# EasyEDA Pro project ProPrj_obstacleavoidanceunit_2025-12-17.epro

# Schematic Schematic1

## Sheets
1 Mux: Board Name: Board1; Create Date: 2025-10-27; Page Name: Mux; Project Name: obstacleavoidanceunit; Schematic Name: Schematic1; Update Date: 2025-11-10; Company: EasyEDA.com; Page Size: A4; Version: V1.0
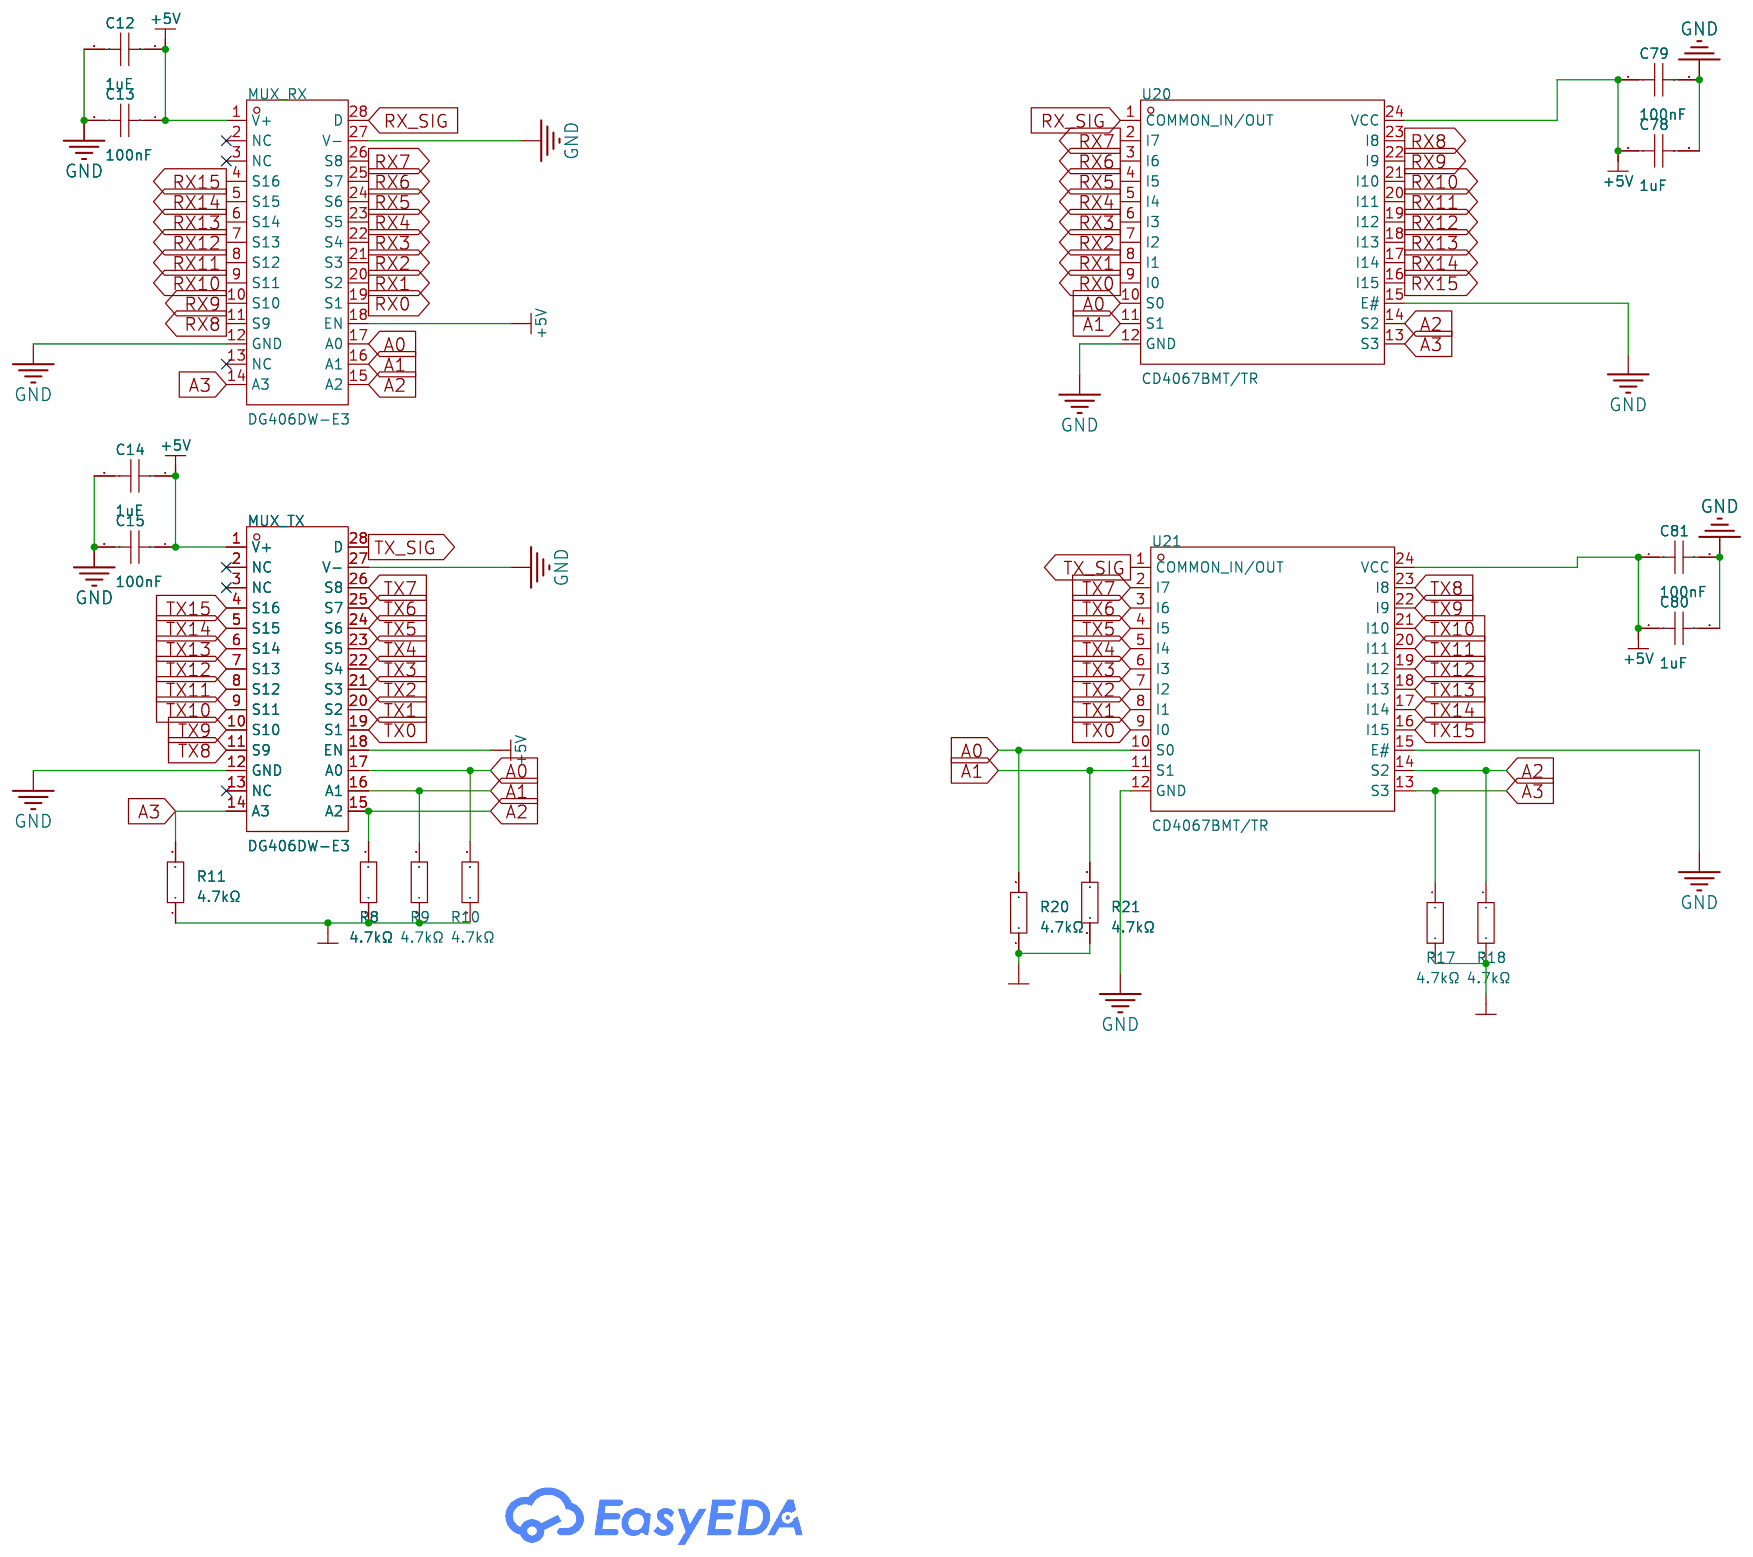
[diagram p0: Mux]
2 Power: Create Date: 2025-10-30; Page Name: Power
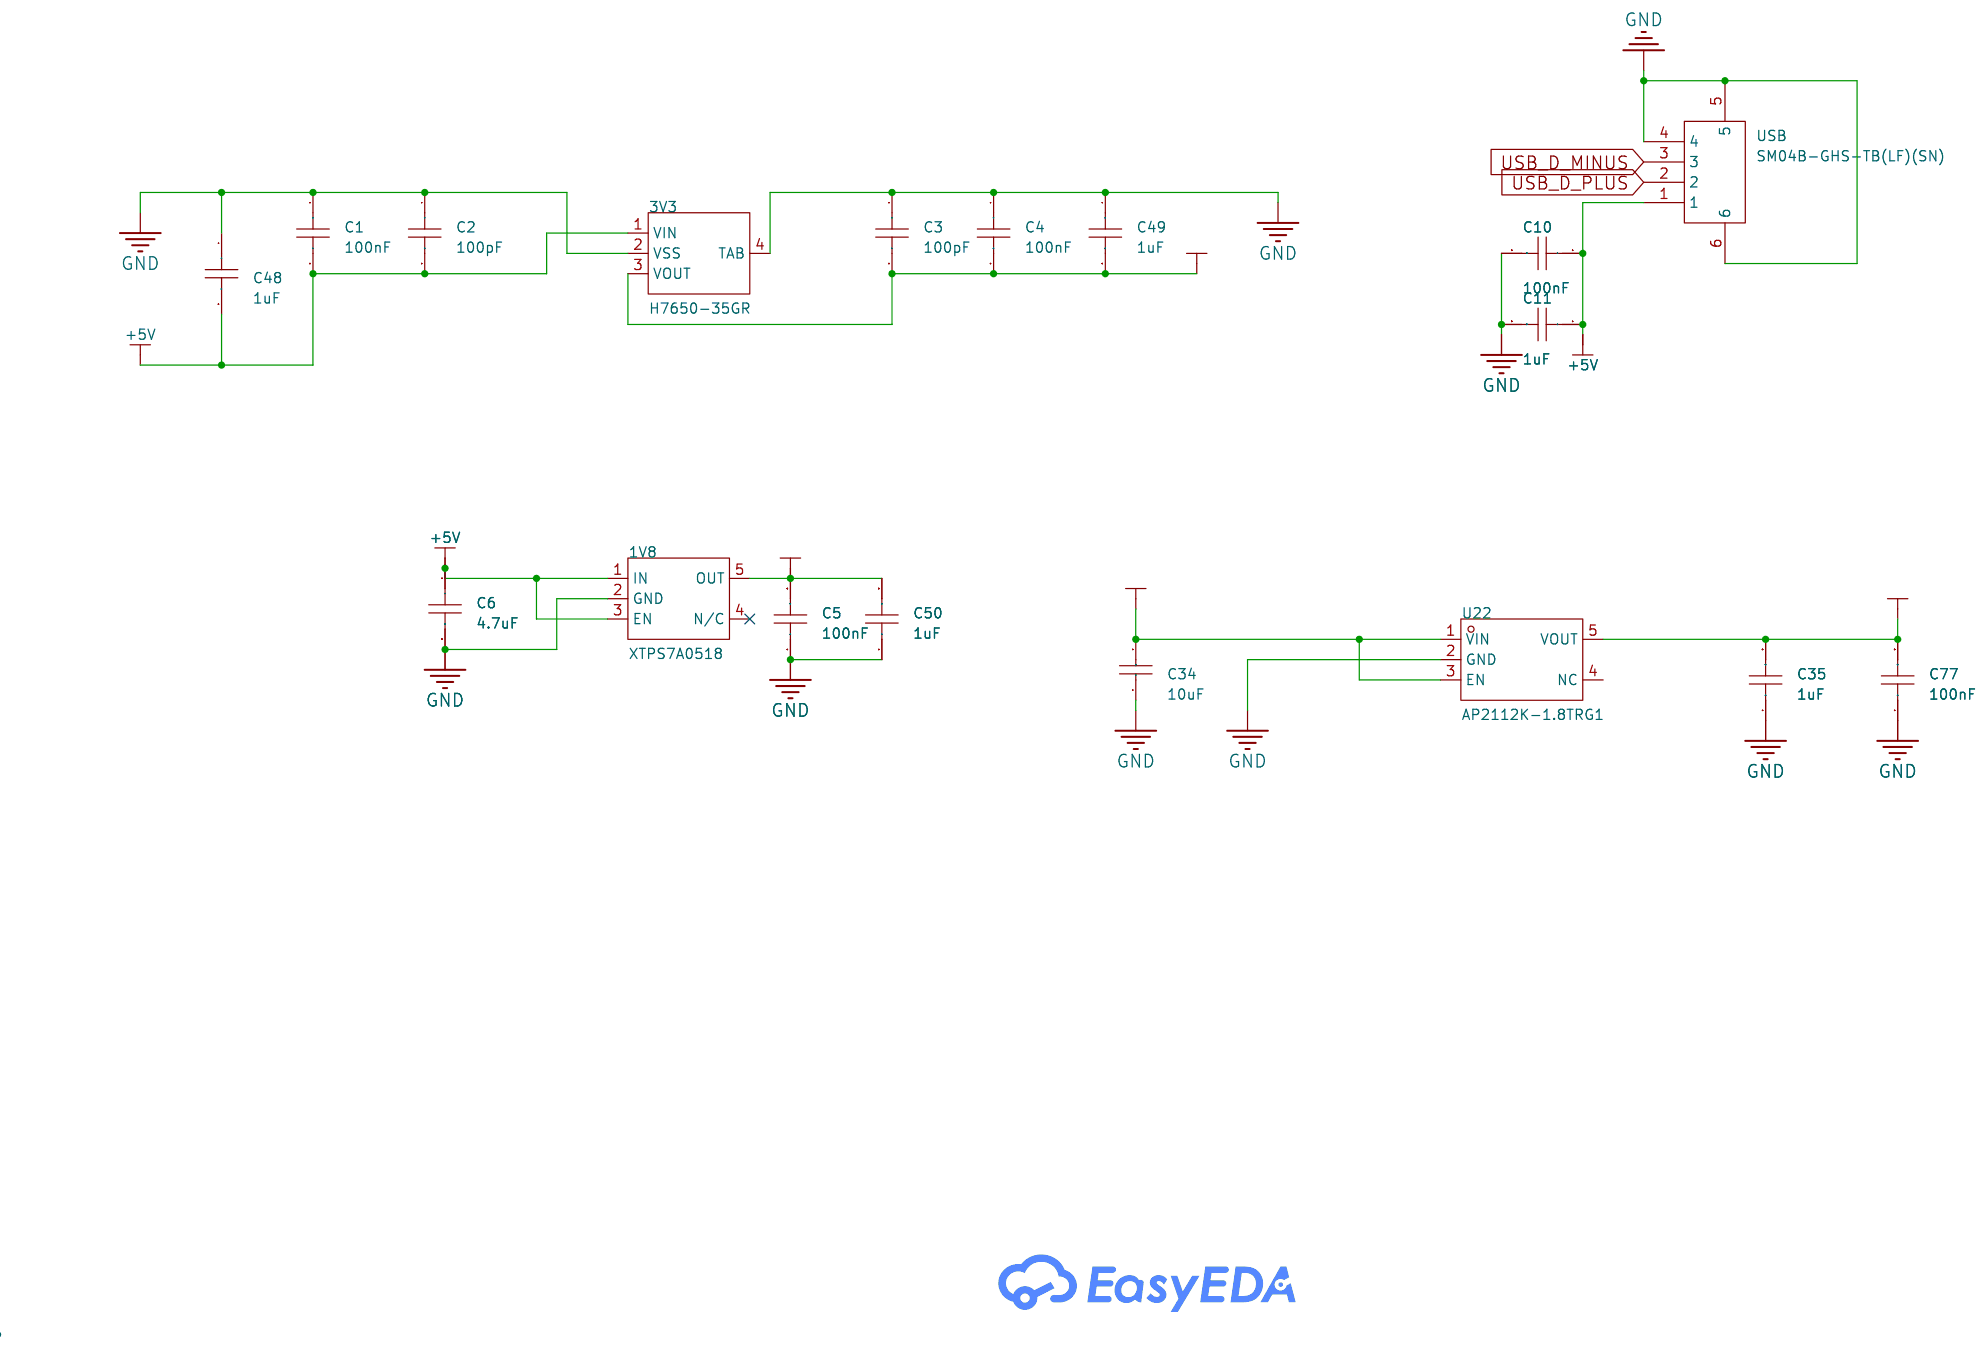
[diagram p1: Power]
3 ESP: Create Date: 2025-11-09; Page Name: ESP
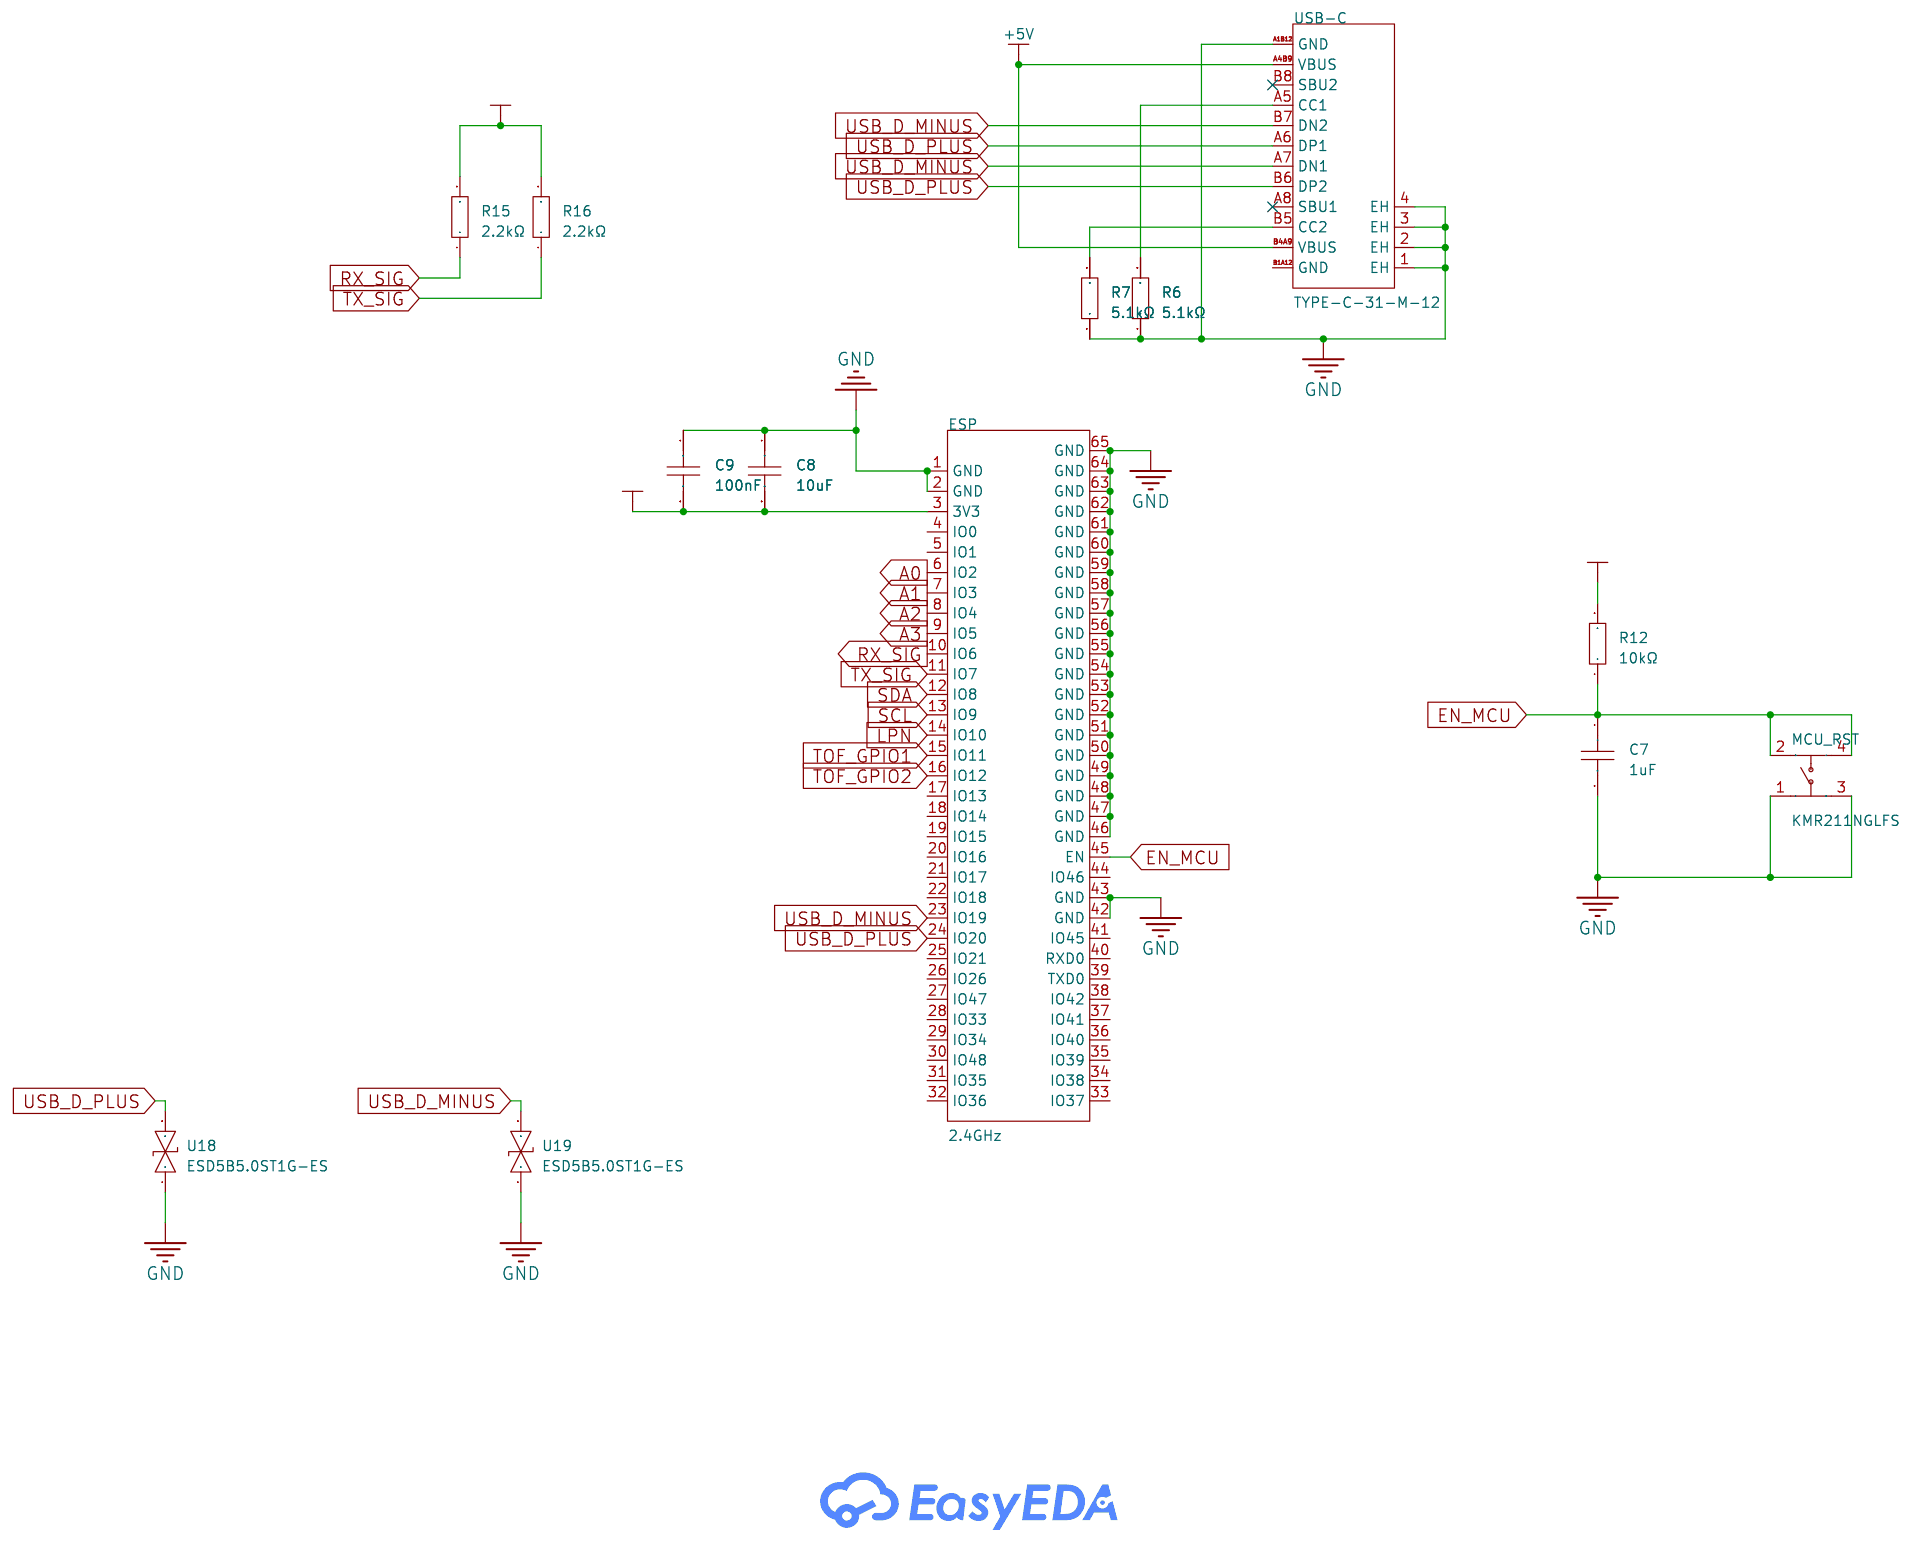
[diagram p2: ESP]
4 connectors: Create Date: 2025-11-10; Page Name: connectors
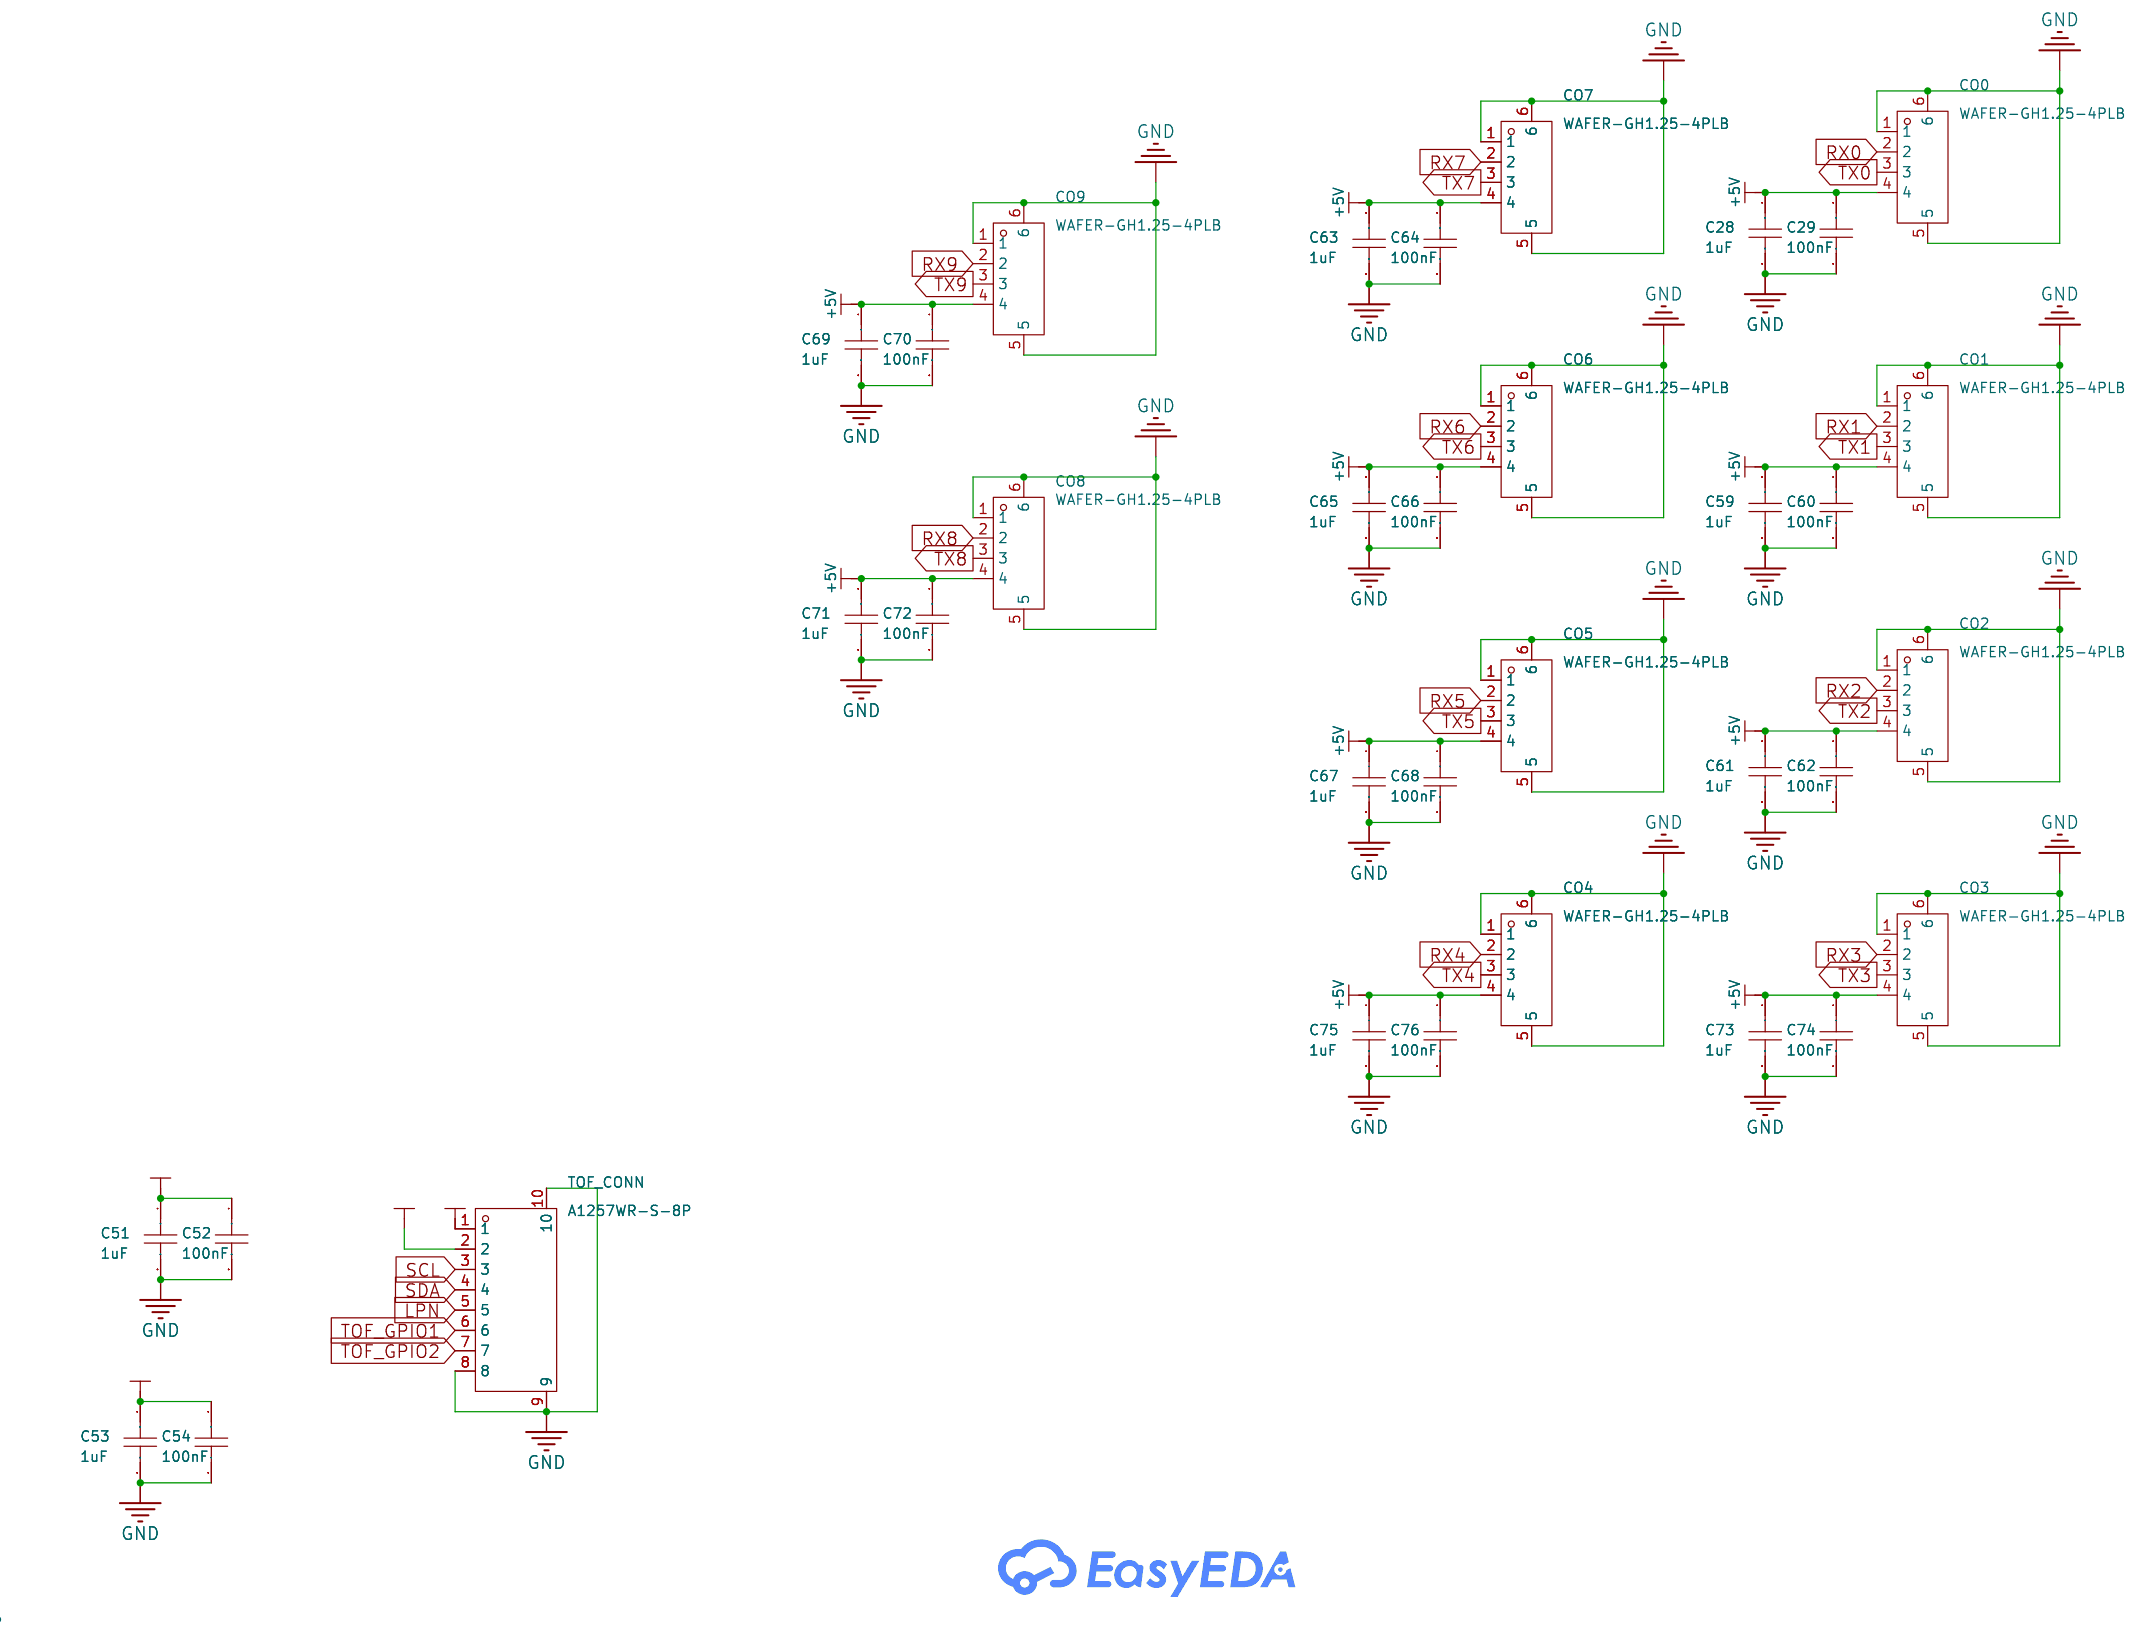
[diagram p3: connectors]
5 TOF: Create Date: 2025-11-10; Page Name: TOF; Drawn: EasyEDA; Part Number: JLCPCB-002; Reviewed: EasyEDA; Version: V0.1
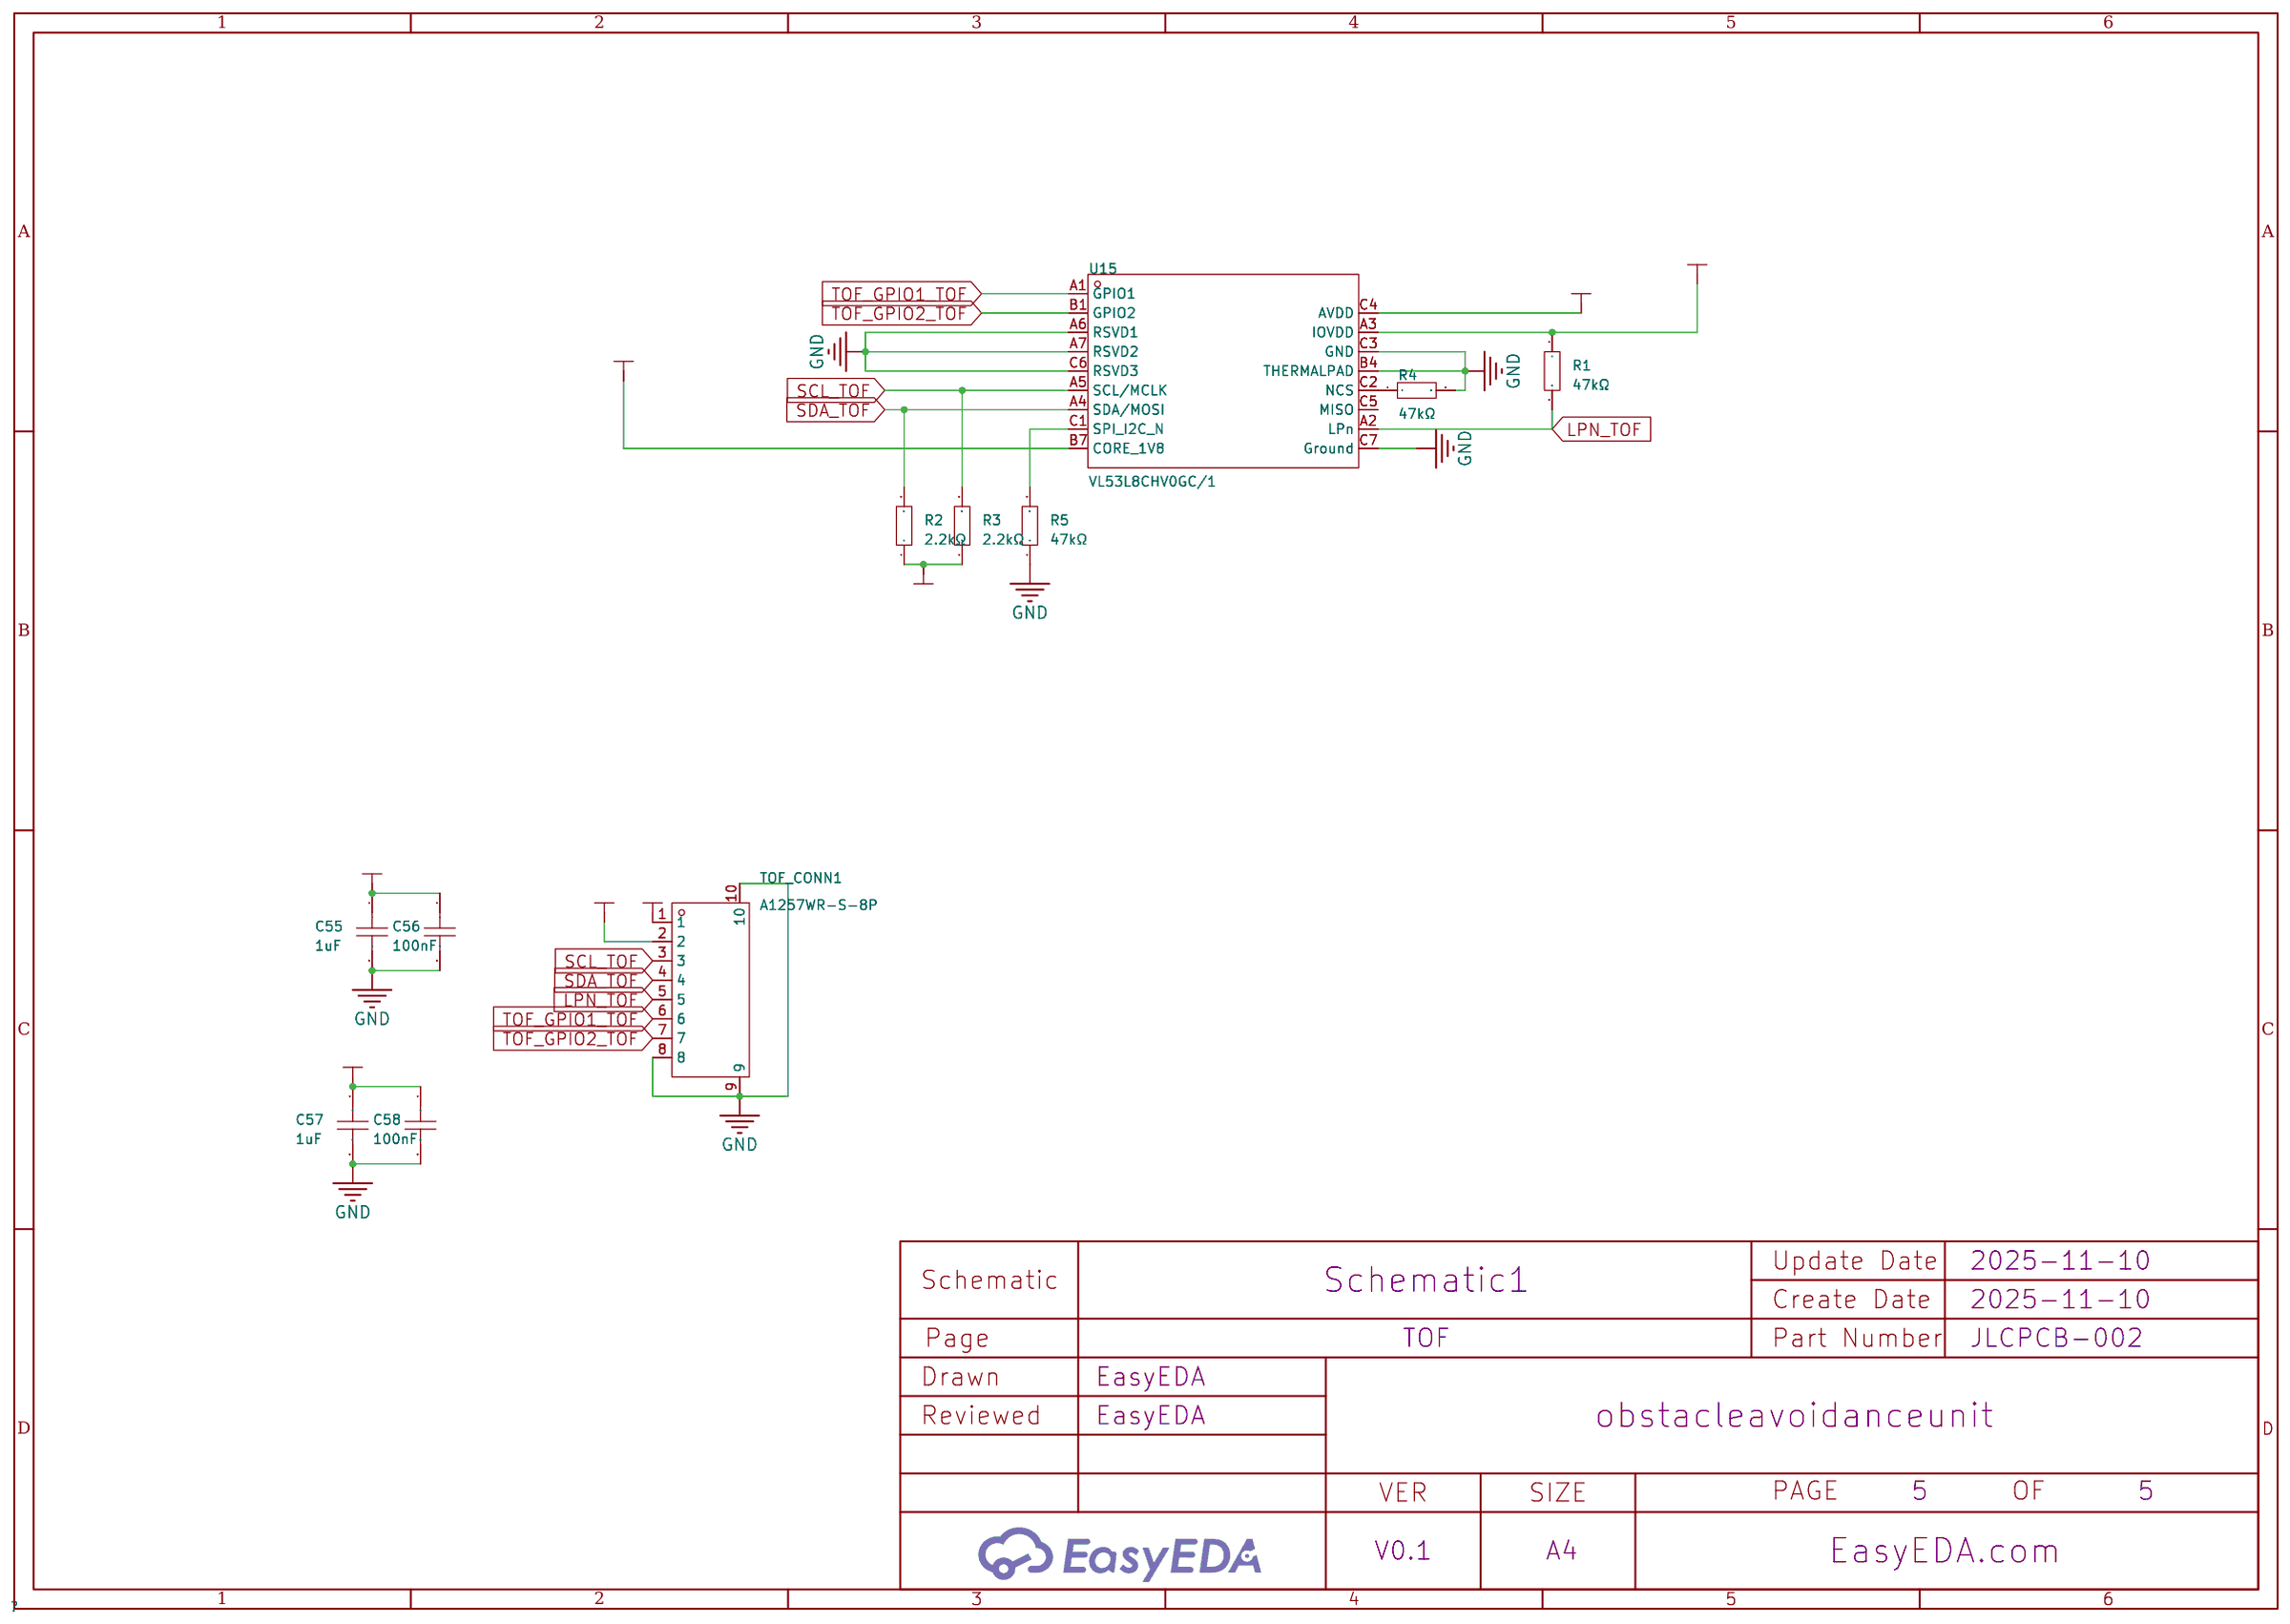
[diagram p4: TOF]

## Parts
sheet connectors
C28  1uF  [C0603]
C29  100nF  [C0603]
C51  1uF  [C0603]
C52  100nF  [C0603]
C53  1uF  [C0603]
C54  100nF  [C0603]
C59  1uF  [C0603]
C60  100nF  [C0603]
C61  1uF  [C0603]
C62  100nF  [C0603]
C63  1uF  [C0603]
C64  100nF  [C0603]
C65  1uF  [C0603]
C66  100nF  [C0603]
C67  1uF  [C0603]
C68  100nF  [C0603]
C69  1uF  [C0603]
C70  100nF  [C0603]
C71  1uF  [C0603]
C72  100nF  [C0603]
C73  1uF  [C0603]
C74  100nF  [C0603]
C75  1uF  [C0603]
C76  100nF  [C0603]
CO0  WAFER-GH1.25-4PLB  [CONN-SMD_4P-P1.25_XUNPU_WAFER-GH1.25-4PLB]
CO1  WAFER-GH1.25-4PLB  [CONN-SMD_4P-P1.25_XUNPU_WAFER-GH1.25-4PLB]
CO2  WAFER-GH1.25-4PLB  [CONN-SMD_4P-P1.25_XUNPU_WAFER-GH1.25-4PLB]
CO3  WAFER-GH1.25-4PLB  [CONN-SMD_4P-P1.25_XUNPU_WAFER-GH1.25-4PLB]
CO4  WAFER-GH1.25-4PLB  [CONN-SMD_4P-P1.25_XUNPU_WAFER-GH1.25-4PLB]
CO5  WAFER-GH1.25-4PLB  [CONN-SMD_4P-P1.25_XUNPU_WAFER-GH1.25-4PLB]
CO6  WAFER-GH1.25-4PLB  [CONN-SMD_4P-P1.25_XUNPU_WAFER-GH1.25-4PLB]
CO7  WAFER-GH1.25-4PLB  [CONN-SMD_4P-P1.25_XUNPU_WAFER-GH1.25-4PLB]
CO8  WAFER-GH1.25-4PLB  [CONN-SMD_4P-P1.25_XUNPU_WAFER-GH1.25-4PLB]
CO9  WAFER-GH1.25-4PLB  [CONN-SMD_4P-P1.25_XUNPU_WAFER-GH1.25-4PLB]
TOF_CONN  A1257WR-S-8P  [CONN-SMD_A1257WR-S-8P]
sheet ESP
C7  1uF  [C0603]
C8  10uF  [C0603]
C9  100nF  [C0603]
ESP  2.4GHz  [BULETM-SMD_ESPRESSIF_ESP32-S3-MINI-1U-N8]
MCU_RST  KMR211NGLFS  [SW-SMD_4P-L4.2-W2.8-P1.60-LS4.6-TR]
R6  5.1kΩ  [R0603]
R7  5.1kΩ  [R0603]
R12  10kΩ  [R0603]
R15  2.2kΩ  [R0603]
R16  2.2kΩ  [R0603]
U18  ESD5B5.0ST1G-ES  [SOD-523_L1.2-W0.8-LS1.6-BI]
U19  ESD5B5.0ST1G-ES  [SOD-523_L1.2-W0.8-LS1.6-BI]
USB-C  TYPE-C-31-M-12  [USB-C_SMD-TYPE-C-31-M-12_1]
sheet Mux
C12  1uF  [C0603]  (no BOM)
C13  100nF  [C0603]  (no BOM)
C14  1uF  [C0603]  (no BOM)
C15  100nF  [C0603]  (no BOM)
C78  1uF  [C0603]
C79  100nF  [C0603]
C80  1uF  [C0603]
C81  100nF  [C0603]
MUX_RX  DG406DW-E3  [SOIC-28_L17.9-W7.5-P1.27-LS10.3-BL]  (no BOM)
MUX_TX  DG406DW-E3  [SOIC-28_L17.9-W7.5-P1.27-LS10.3-BL]  (no BOM)
R8  4.7kΩ  [R0603]  (no BOM)
R9  4.7kΩ  [R0603]  (no BOM)
R10  4.7kΩ  [R0603]  (no BOM)
R11  4.7kΩ  [R0603]  (no BOM)
R17  4.7kΩ  [R0603]
R18  4.7kΩ  [R0603]
R20  4.7kΩ  [R0603]
R21  4.7kΩ  [R0603]
U20  CD4067BMT/TR  [TSSOP-24_L7.8-W4.4-P0.65-LS6.4-BL_1]
U21  CD4067BMT/TR  [TSSOP-24_L7.8-W4.4-P0.65-LS6.4-BL_1]
sheet Power
1V8  XTPS7A0518  [SOT-23-5_L2.9-W1.6-P0.95-LS2.8-BL]  (no BOM)
3V3  H7650-35GR  [SOT-223-3_L6.5-W3.4-P2.30-LS7.0-BR]
C1  100nF  [C0402]
C2  100pF  [C0402]
C3  100pF  [C0402]
C4  100nF  [C0402]
C5  100nF  [C0402]  (no BOM)
C6  4.7uF  [C0603]  (no BOM)
C10  100nF  [C0603]
C11  1uF  [C0603]
C34  10uF  [C0402]
C35  1uF  [C0603]
C48  1uF  [C0603]
C49  1uF  [C0603]
C50  1uF  [C0603]  (no BOM)
C77  100nF  [C0402]
U22  AP2112K-1.8TRG1  [SOT-25_L3.0-W1.6-P0.95-LS2.8-BL]
USB  SM04B-GHS-TB(LF)(SN)  [CONN-SMD_4P-P1.25_SM04B-GHS-TB-LF-SN]
sheet TOF
C55  1uF  [C0603]
C56  100nF  [C0603]
C57  1uF  [C0603]
C58  100nF  [C0603]
R1  47kΩ  [R0603]
R2  2.2kΩ  [R0603]
R3  2.2kΩ  [R0603]
R4  47kΩ  [R0603]
R5  47kΩ  [R0603]
TOF_CONN1  A1257WR-S-8P  [CONN-SMD_A1257WR-S-8P]
U15  VL53L8CHV0GC/1  [LGA-16_L6.4-W3.0_VL53L5CXV0GC-1]

## Library data of the parts
C7 C11 C12 C14 C28 C35 C48-C51 C53 C55 C57 C59 C61 C63 C65 C67 C69 C71 C73 C75 C78 C80 = CL10A105KB8NNNC: Capacitance:1uF Tolerance:±10% Tolerance:±10% Voltage Rating:50V Temperature Coefficient:X5R; LCSC Part Name: 1uF ±10% 50V; Supplier Part: C15849; Manufacturer: SAMSUNG(三星); Supplier Footprint: 0603; JLCPCB Part Class: Basic Part; Datasheet: https://item.szlcsc.com/datasheet/CL10A105KB8NNNC/16531.html; Supplier: LCSC; Tolerance: ±10%; Voltage Rating: 50V; Temperature Coefficient: X5R
C9 C10 C13 C15 C29 C52 C54 C56 C58 C60 C62 C64 C66 C68 C70 C72 C74 C76 C79 C81 = CC0603KRX7R9BB104: Capacitance:100nF Tolerance:±10% Tolerance:±10% Voltage Rating:50V Temperature Coefficient:X7R; LCSC Part Name: 100nF ±10% 50V; Supplier Part: C14663; Manufacturer: YAGEO(国巨); Supplier Footprint: 0603; JLCPCB Part Class: Basic Part; Datasheet: https://item.szlcsc.com/datasheet/CC0603KRX7R9BB104/15331.html; Supplier: LCSC; Tolerance: ±10%; Voltage Rating: 50V; Temperature Coefficient: X7R
CO0-CO9 = WAFER-GH1.25-4PLB: Pins Structure:1x4P Pitch:1.25mm Mounting Type:Surface Mount,Vertical Reference Series:GH Number of Pins:4P Number of Rows:1 Number of PINs Per Row:4 Row Spacing:- Current Rating:1A Contact Material:Brass Contact Plating:Tin Operating Temperature:-25℃~+85; LCSC Part Name: 1x4P 间距:1.25mm 立贴 系列:GH; Supplier Part: C3029370; Manufacturer: XUNPU(讯普); Supplier Footprint: SMD,P=1.25mm; JLCPCB Part Class: Extended Part; Datasheet: https://item.szlcsc.com/datasheet/WAFER-GH1.25-4PLB/3561382.html; Supplier: LCSC; Pins Structure: 1x4P; Pitch: 1.25mm; Mounting Type: Surface Mount,Vertical; Reference Series: GH; Number of Pins: 4P; Number of Rows: 1; Number of PINs Per Row: 4; Current Rating: 1A; Contact Material: Brass; Contact Plating: Tin; Operating Temperature: -25℃~+85℃; Voltage Rating: 125V; Plastic Material: LCP; Supplementary Features: Auxiliary Solder Pin; Color: Beige; Z-Height of the Board: 4.2mm; X-Length of Bottom Edge on Board (Spacing Line): 8.25mm; Y-Width of Bottom Edge on Board: 4.95mm
TOF_CONN TOF_CONN1 = A1257WR-S-8P_C225131: Pins Structure:1x8P Pitch:1.25mm Mounting Type:Surface Mount, Right Angle Reference Series:GH Number of Pins:8P Number of Rows:1 Number of PINs Per Row:8 Row Spacing:- Current Rating:1A Contact Material:Phosphor Bronze Contact Plating:Tin Operating Temper; LCSC Part Name: 1x8P 间距:1.25mm 卧贴 系列:GH; Supplier Part: C225131; Manufacturer: CJT(长江连接器); Supplier Footprint: SMD,P=1.25mm,卧贴; JLCPCB Part Class: Extended Part; Datasheet: https://item.szlcsc.com/datasheet/A1257WR-S-8P/225414.html; Supplier: LCSC; Pins Structure: 1x8P; Pitch: 1.25mm; Mounting Type: Surface Mount, Right Angle; Reference Series: GH; Number of Pins: 8P; Number of Rows: 1; Number of PINs Per Row: 8; Current Rating: 1A; Contact Material: Phosphor Bronze; Contact Plating: Tin; Operating Temperature: -40℃~+105℃; Voltage Rating: 50V; Plastic Material: PA9T; Flame Retardant Rating: UL94V-0
C8 = CL10A106KP8NNNC: Capacitance:10uF Tolerance:±10% Tolerance:±10% Voltage Rating:10V Temperature Coefficient:X5R; LCSC Part Name: 10uF ±10% 10V; Supplier Part: C19702; Manufacturer: SAMSUNG(三星); Supplier Footprint: 0603; JLCPCB Part Class: Basic Part; Datasheet: https://item.szlcsc.com/datasheet/CL10A106KP8NNNC/20411.html; Supplier: LCSC; Tolerance: ±10%; Voltage Rating: 10V; Temperature Coefficient: X5R
ESP = ESP32-S3-MINI-1U-N8: Interface Type:I2S；I2C；UART；USB；SDIO；SPI；JTAG Frequency:2.4GHz Output Power:21dBm Output Power:21dBm; Supplier Part: C2980299; Manufacturer: ESPRESSIF(乐鑫); Supplier Footprint: VFQFN-56-EP; JLCPCB Part Class: Extended Part; Datasheet: https://item.szlcsc.com/datasheet/ESP32-S3-MINI-1U-N8/3401551.html; Supplier: LCSC; Interface Type: I2S；I2C；UART；USB；SDIO；SPI；JTAG; Output Power: 21dBm
MCU_RST = KMR211NGLFS: Circuit:SPST - normally open Actuator Style:Round Button Operating Force:120gf Mounting Style:Standing paste Contact Current:50mA Voltage Rating (DC):32V Pin Style:Gullwing Operating Temperature:-40℃~+85℃ Operating Temperature:-40℃~+85℃; Supplier Part: C221676; Manufacturer: C&K; Supplier Footprint: SMD; JLCPCB Part Class: Extended Part; Datasheet: https://atta.szlcsc.com/upload/public/pdf/source/20211209/3EBDA2FC8F99CA5B8B2AE6B679EE7E99.pdf; Supplier: LCSC; Circuit: SPST - normally open; Actuator Style: Round Button; Operating Force: 120gf; Mounting Style: Standing paste; Contact Current: 50mA; Voltage Rating (DC): 32V; Pin Style: Gullwing; Operating Temperature: -40℃~+85℃
R6 R7 = 0603WAF5101T5E: Type:Thick Film Resistor Resistance:5.1kΩ Tolerance:±1% Tolerance:±1% Power(Watts):100mW Voltage-Supply(Max):75V Temperature Coefficient:±100ppm/℃ Temperature Coefficient:±100ppm/℃ Operating Temperature:-55℃~+155℃ Operating Temperature:-55℃~+155℃; LCSC Part Name: 5.1kΩ ±1% 100mW 厚膜电阻; Supplier Part: C23186; Manufacturer: UNI-ROYAL(厚声); Supplier Footprint: 0603; JLCPCB Part Class: Basic Part; Datasheet: https://item.szlcsc.com/datasheet/0603WAF5101T5E/23913.html; Supplier: LCSC; Type: Thick Film Resistor; Tolerance: ±1%; Power(Watts): 100mW; Voltage-Supply(Max): 75V; Temperature Coefficient: ±100ppm/℃; Operating Temperature: -55℃~+155℃
R12 = 0603WAF1002T5E: Type:Thick Film Resistor Resistance:10kΩ Tolerance:±1% Tolerance:±1% Power(Watts):100mW Voltage-Supply(Max):75V Temperature Coefficient:±100ppm/℃ Temperature Coefficient:±100ppm/℃ Operating Temperature:-55℃~+155℃ Operating Temperature:-55℃~+155℃; LCSC Part Name: 厚膜电阻 10kΩ ±1% 100mW; Supplier Part: C25804; Manufacturer: UNI-ROYAL(厚声); Supplier Footprint: 0603; JLCPCB Part Class: Basic Part; Datasheet: https://item.szlcsc.com/datasheet/0603WAF1002T5E/26547.html; Supplier: LCSC; Type: Thick Film Resistor; Tolerance: ±1%; Power(Watts): 100mW; Voltage-Supply(Max): 75V; Temperature Coefficient: ±100ppm/℃; Operating Temperature: -55℃~+155℃
R2 R3 R15 R16 = 0603WAF2201T5E_C4190: Type:Thick Film Resistors Resistance:2.2kΩ Tolerance:±1% Tolerance:±1% Power(Watts): Overload Voltage (Max): Temperature Coefficient:±100ppm/℃ Temperature Coefficient:±100ppm/℃ Operating Temperature Range:-55℃~+155℃ Operating Temperature Range:-55℃~+155℃; LCSC Part Name: 2.2kΩ ±1% 100mW 厚膜电阻; Supplier Part: C4190; Manufacturer: UNI-ROYAL(厚声); Manufacturer Part: 0603WAF2201T5E; Supplier Footprint: 0603; JLCPCB Part Class: Basic Part; Datasheet: https://atta.szlcsc.com/upload/public/pdf/source/20200306/C422600_1E6D84923E4A46A82E41ADD87F860B5C.pdf; Supplier: LCSC; Type: Thick Film Resistors; Tolerance: ±1%; Temperature Coefficient: ±100ppm/℃; Operating Temperature Range: -55℃~+155℃
U18 U19 = ESD5B5.0ST1G-ES: Polarity:Bidirectional Reverse Stand-Off Voltage (Vrwm):5V Clamping Voltage:10V Peak Pulse Current (Ipp):8A Peak Pulse Power Dissipation (Ppp):80W Voltage - Breakdown:5.8V Reverse Leakage Current (Ir):1uA Number of Channels:1.0 Operating Temperature:-40℃~; LCSC Part Name: 普容5.0V，单路双向ESD静电防护器件，30kV，CJ：12pF；音频/视频/通讯防护; Supplier Part: C5180228; Manufacturer: ElecSuper(静芯); Supplier Footprint: SOD-523; JLCPCB Part Class: Extended Part; Datasheet: https://item.szlcsc.com/datasheet/ESD5B5.0ST1G-ES/5837566.html; Supplier: LCSC; Polarity: Bidirectional; Reverse Stand-Off Voltage (Vrwm): 5V; Clamping Voltage: 10V; Peak Pulse Current (Ipp): 8A; Peak Pulse Power Dissipation (Ppp): 80W; Voltage - Breakdown: 5.8V; Reverse Leakage Current (Ir): 1uA; Number of Channels: 1.0; Operating Temperature: -40℃~+125℃; level of protection: IEC 61000-4-2; Type: ESD; Junction Capacitance: 15pF
USB-C = TYPE-C-31-M-12: Connector Type:Type-C Protocol Standard:- Gender:Female Mounting Type:- Number of Contacts:16P Number of Ports:1 Current Rating-Power:5A Operating Temperature:- Operating Temperature:-; LCSC Part Name: Type-C 母; Supplier Part: C165948; Manufacturer: 韩国韩荣; Supplier Footprint: SMD; JLCPCB Part Class: Extended Part; Datasheet: https://item.szlcsc.com/datasheet/TYPE-C-31-M-12/177331.html; Supplier: LCSC; Connector Type: Type-C; Gender: Female; Number of Contacts: 16P; Number of Ports: 1; Current Rating-Power: 5A
MUX_RX MUX_TX = DG406DW-E3: Switch Circuit:16:1 Number of Channels:16 Voltage - Supply:-20V~-5V；12V；5V~20V Voltage - Supply:-20V~-5V；12V；5V~20V Turn-on time:350ns Ron:50Ω Turn-off time:300ns Operating Temperature:-40℃~+85℃ Operating Temperature:-40℃~+85℃ Con:140pF; LCSC Part Name: 16通道/双8通道高性能CMOS模拟多路复用器; Supplier Part: C426318; Manufacturer: VISHAY(威世); Supplier Footprint: SOIC-28-300mil; JLCPCB Part Class: Extended Part; Datasheet: https://item.szlcsc.com/datasheet/DG406DW-E3/419971.html; Supplier: LCSC; Switch Circuit: 16:1; Number of Channels: 16; Voltage - Supply: -20V~-5V；12V；5V~20V; Turn-on time: 350ns; Ron: 50Ω; Turn-off time: 300ns; Operating Temperature: -40℃~+85℃; Con: 140pF
R8-R11 R17 R18 R20 R21 = 0603WAF4701T5E: Type:Thick Film Resistor Resistance:4.7kΩ Tolerance:±1% Tolerance:±1% Power(Watts):100mW Voltage-Supply(Max):75V Temperature Coefficient:±100ppm/℃ Temperature Coefficient:±100ppm/℃ Operating Temperature:-55℃~+155℃ Operating Temperature:-55℃~+155℃; LCSC Part Name: 4.7kΩ ±1% 100mW 厚膜电阻; Supplier Part: C23162; Manufacturer: UNI-ROYAL(厚声); Supplier Footprint: 0603; JLCPCB Part Class: Basic Part; Datasheet: https://item.szlcsc.com/datasheet/0603WAF4701T5E/23889.html; Supplier: LCSC; Type: Thick Film Resistor; Tolerance: ±1%; Power(Watts): 100mW; Voltage-Supply(Max): 75V; Temperature Coefficient: ±100ppm/℃; Operating Temperature: -55℃~+155℃
U20 U21 = CD4067BMT/TR: Switch Circuit:Single Knife Sixteen Throw (SP16T) Number of Channels:16 Voltage - Supply:3V~9V Voltage - Supply:3V~9V RDS(on):1.3kΩ Operating Temperature:-40℃~+105℃ Operating Temperature:-40℃~+105℃; LCSC Part Name: 16通道模拟多路复用器/多路分离器; Supplier Part: C7432333; Manufacturer: HGSEMI(华冠); Supplier Footprint: TSSOP-24; JLCPCB Part Class: Extended Part; Datasheet: https://atta.szlcsc.com/upload/public/pdf/source/20230815/971099B3440A45CE083B1C106516F24A.pdf; Supplier: LCSC; Switch Circuit: Single Knife Sixteen Throw (SP16T); Number of Channels: 16; Voltage - Supply: 3V~9V; RDS(on): 1.3kΩ; Operating Temperature: -40℃~+105℃
1V8 = XTPS7A0518: Output Type:Fixed Voltage - Supply:5.5V Output Voltage:1.8V Output Voltage:1.8V Output Current:200mA Power Supply Rejection Ratio (PSRR):62dB@(1kHz) Voltage Dropout:200mV@(200mA) standby current:15uA Noise:9uVrms Features:Over Current Protection；Enable；Ov; LCSC Part Name: 5.5V 电源供电，能提供高达 200mA 输出电; Supplier Part: C51953299; Manufacturer: SiChange(芯昌科技); Supplier Footprint: SOT-23-5; JLCPCB Part Class: Extended Part; Datasheet: https://item.szlcsc.com/datasheet/XTPS7A0518/54680483.html; Supplier: LCSC; Output Type: Fixed; Voltage - Supply: 5.5V; Output Voltage: 1.8V; Output Current: 200mA; Power Supply Rejection Ratio (PSRR): 62dB@(1kHz); Voltage Dropout: 200mV@(200mA); standby current: 15uA; Noise: 9uVrms; Features: Over Current Protection；Enable；Over Temperature Protection; Operating Temperature: -40℃~+125℃@(Ta); Output Configuration: Positive; Number of Outputs: 1
3V3 = H7650-35GR: Output Type:Fixed Voltage - Supply:8V Output Voltage:3.5V Output Voltage:3.5V Output Current:750mA Power Supply Rejection Ratio (PSRR):70dB@(1kHz) Voltage Dropout:60mV@(100mA) standby current:25uA Features:Over Temperature Protection；Thermal Shutdown Oper; LCSC Part Name: 输入10V 输出3.5V 750mA; Supplier Part: C411046; Manufacturer: Siproin(上海矽朋); Supplier Footprint: SOT-223-3; JLCPCB Part Class: Extended Part; Datasheet: https://atta.szlcsc.com/upload/public/pdf/source/20190808/C411048_BD949128455318DDF9723CA68E2A983D.pdf; Supplier: LCSC; Output Type: Fixed; Voltage - Supply: 8V; Output Voltage: 3.5V; Output Current: 750mA; Power Supply Rejection Ratio (PSRR): 70dB@(1kHz); Voltage Dropout: 60mV@(100mA); standby current: 25uA; Features: Over Temperature Protection；Thermal Shutdown; Operating Temperature: -40℃~+85℃; Output Configuration: Positive; Number of Outputs: 1
C1 C4 C5 C77 = CC0402KRX7R7BB104: Capacitance: Tolerance:±10% Tolerance:±10% Voltage Rated: Temperature Coefficient:; LCSC Part Name: 100nF ±10% 16V; Supplier Part: C60474; Manufacturer: YAGEO(国巨); Supplier Footprint: 0402; JLCPCB Part Class: Extended Part; Datasheet: https://atta.szlcsc.com/upload/public/pdf/source/20211223/9278FD768280B81DDBEF48FA36411A03.pdf; Supplier: LCSC; Tolerance: ±10%
C2 C3 = 0402CG101J500NT: Capacitance: Tolerance:±5% Tolerance:±5% Voltage Rated: Temperature Coefficient:; LCSC Part Name: 100pF ±5% 50V; Supplier Part: C1546; Manufacturer: FH(风华); Supplier Footprint: 0402; JLCPCB Part Class: Basic Part; Datasheet: https://atta.szlcsc.com/upload/public/pdf/source/20200305/C486355_26A10D38EF8C2A5C37091D0039909270.pdf; Supplier: LCSC; Tolerance: ±5%
C6 = CL10A475KP8NNNC: Capacitance:4.7uF Tolerance:±10% Tolerance:±10% Voltage Rating:10V Temperature Coefficient:X5R; LCSC Part Name: 4.7uF ±10% 10V; Supplier Part: C1705; Manufacturer: SAMSUNG(三星); Supplier Footprint: 0603; JLCPCB Part Class: Extended Part; Datasheet: https://item.szlcsc.com/datasheet/CL10A475KP8NNNC/2057.html; Supplier: LCSC; Tolerance: ±10%; Voltage Rating: 10V; Temperature Coefficient: X5R
C34 = CC0402MRX5R5BB106: Capacitance: Tolerance:±20% Tolerance:±20% Voltage Rated: Temperature Coefficient:; LCSC Part Name: 10uF ±20% 6.3V; Supplier Part: C105884; Manufacturer: YAGEO(国巨); Supplier Footprint: 0402; JLCPCB Part Class: Extended Part; Datasheet: https://atta.szlcsc.com/upload/public/pdf/source/20181008/C309506_01C87B2C86DBD1236B532041A9B60642.pdf; Supplier: LCSC; Tolerance: ±20%
U22 = AP2112K-1.8TRG1: Output Type:Fixed Voltage - Supply:6V Output Voltage:1.8V Output Voltage:1.8V Output Current:600mA Power Supply Rejection Ratio (PSRR):65dB@(1kHz) Voltage Dropout:500mV@(600mA) standby current:55uA Noise:50uVrms Features:Over Current Protection；Enable；Ove; LCSC Part Name: 600mA CMOS低压差线性稳压器; Supplier Part: C176944; Manufacturer: DIODES(美台); Supplier Footprint: SOT-25; JLCPCB Part Class: Extended Part; Datasheet: https://item.szlcsc.com/datasheet/AP2112K-1.8TRG1/188335.html; Supplier: LCSC; Output Type: Fixed; Voltage - Supply: 6V; Output Voltage: 1.8V; Output Current: 600mA; Power Supply Rejection Ratio (PSRR): 65dB@(1kHz); Voltage Dropout: 500mV@(600mA); standby current: 55uA; Noise: 50uVrms; Features: Over Current Protection；Enable；Over Temperature Protection; Operating Temperature: -40℃~+85℃@(Ta); Output Configuration: Positive; Number of Outputs: 1
USB = SM04B-GHS-TB(LF)(SN): Pins Structure:1x4P Pitch:1.25mm Mounting Style:Horizontal attachment Reference Series:GH Number of Pins:4P Number of Rows:1 Number of PINs Per Row:4 Row Spacing:- Current Rating (Max):1A Contact Material:Phosphor Bronze Contact Plating:Tin Operating Temp; LCSC Part Name: 1x4P 间距:1.25mm 卧贴 系列:GH; Supplier Part: C189895; Manufacturer: JST; Supplier Footprint: SMD,P=1.25mm,卧贴; JLCPCB Part Class: Extended Part; Datasheet: https://atta.szlcsc.com/upload/public/pdf/source/20180323/112205B2CF875947C9562BFC7B01FA26.pdf; Supplier: LCSC; Pins Structure: 1x4P; Pitch: 1.25mm; Mounting Style: Horizontal attachment; Reference Series: GH; Number of Pins: 4P; Number of Rows: 1; Number of PINs Per Row: 4; Current Rating (Max): 1A; Contact Material: Phosphor Bronze; Contact Plating: Tin; Operating Temperature Range: -25℃~+85℃; Rated Voltage (Max): 50V; Plastic Material: PA9T; Flame Retardant Rating: UL94V-0; Supplementary Features: Auxiliary soldering legs; Colour: White; Z-Height of the Board: 4.25mm; X-Length of Bottom Edge on Board (Spacing Line): 8.25mm; Y-Width of Bottom Edge on Board: 4.13mm
R1 R4 R5 = 0603WAF4702T5E: Type:Thick Film Resistor Resistance:47kΩ Tolerance:±1% Tolerance:±1% Power(Watts):100mW Voltage-Supply(Max):75V Temperature Coefficient:±100ppm/℃ Temperature Coefficient:±100ppm/℃ Operating Temperature:-55℃~+155℃ Operating Temperature:-55℃~+155℃; LCSC Part Name: 47kΩ ±1% 100mW 厚膜电阻; Supplier Part: C25819; Manufacturer: UNI-ROYAL(厚声); Supplier Footprint: 0603; JLCPCB Part Class: Basic Part; Datasheet: https://item.szlcsc.com/datasheet/0603WAF4702T5E/26562.html; Supplier: LCSC; Type: Thick Film Resistor; Tolerance: ±1%; Power(Watts): 100mW; Voltage-Supply(Max): 75V; Temperature Coefficient: ±100ppm/℃; Operating Temperature: -55℃~+155℃
U15 = VL53L8CHV0GC/1: Supplier Part: C20033937; Manufacturer: ST(意法半导体); JLCPCB Part Class: Extended Part; Supplier: LCSC

## Nets
+1V8: 1V8.5(OUT) C5.2 C35.2 C50.2 C53.1 C54.1 C77.2 TOF_CONN.2 U22.5(VOUT)
+1V8_TOF: C57.1 C58.1 R1.1 R2.1 R3.1 TOF_CONN1.2 U15.A3(IOVDD) U15.B7(CORE_1V8)
+3V3: 3V3.3(VOUT) C3.2 C4.2 C8.2 C9.2 C49.2 C51.1 C52.1 ESP.3(3V3) R8.1 R9.1 R10.1 R11.1 R12.2 R15.2 R16.2 R17.1 R18.1 R20.1 R21.1 TOF_CONN.1
+3V3_TOF: C55.1 C56.1 TOF_CONN1.1 U15.C4(AVDD)
+5V: 1V8.1(IN) 1V8.3(EN) 3V3.1(VIN) C1.2 C2.2 C6.1 C10.1 C11.1 C12.1 C13.1 C14.1 C15.1 C28.1 C29.1 C34.2 C48.2 C59.1 C60.1 C61.1 C62.1 C63.1 C64.1 C65.1 C66.1 C67.1 C68.1 C69.1 C70.1 C71.1 C72.1 C73.1 C74.1 C75.1 C76.1 C78.1 C79.1 C80.1 C81.1 CO0.4 CO1.4 CO2.4 CO3.4 CO4.4 CO5.4 CO6.4 CO7.4 CO8.4 CO9.4 MUX_RX.1(V+) MUX_RX.18(EN) MUX_TX.1(V+) MUX_TX.18(EN) U20.24(VCC) U21.24(VCC) U22.1(VIN) U22.3(EN) USB.1 USB-C.A4B9(VBUS) USB-C.B4A9(VBUS)
GND: 1V8.2(GND) 3V3.2(VSS) 3V3.4(TAB) C1.1 C2.1 C3.1 C4.1 C5.1 C6.2 C7.2 C8.1 C9.1 C10.2 C11.2 C12.2 C13.2 C14.2 C15.2 C28.2 C29.2 C34.1 C35.1 C48.1 C49.1 C50.1 C51.2 C52.2 C53.2 C54.2 C55.2 C56.2 C57.2 C58.2 C59.2 C60.2 C61.2 C62.2 C63.2 C64.2 C65.2 C66.2 C67.2 C68.2 C69.2 C70.2 C71.2 C72.2 C73.2 C74.2 C75.2 C76.2 C77.1 C78.2 C79.2 C80.2 C81.2 CO0.1 CO0.5 CO0.6 CO1.1 CO1.5 CO1.6 CO2.1 CO2.5 CO2.6 CO3.1 CO3.5 CO3.6 CO4.1 CO4.5 CO4.6 CO5.1 CO5.5 CO5.6 CO6.1 CO6.5 CO6.6 CO7.1 CO7.5 CO7.6 CO8.1 CO8.5 CO8.6 CO9.1 CO9.5 CO9.6 ESP.1(GND) ESP.2(GND) ESP.42(GND) ESP.43(GND) ESP.46(GND) ESP.47(GND) ESP.48(GND) ESP.49(GND) ESP.50(GND) ESP.51(GND) ESP.52(GND) ESP.53(GND) ESP.54(GND) ESP.55(GND) ESP.56(GND) ESP.57(GND) ESP.58(GND) ESP.59(GND) ESP.60(GND) ESP.61(GND) ESP.62(GND) ESP.63(GND) ESP.64(GND) ESP.65(GND) MCU_RST.1 MCU_RST.3 MUX_RX.12(GND) MUX_RX.27(V-) MUX_TX.12(GND) MUX_TX.27(V-) R4.2 R5.1 R6.1 R7.1 TOF_CONN.8 TOF_CONN.9 TOF_CONN.10 TOF_CONN1.8 TOF_CONN1.9 TOF_CONN1.10 U15.A6(RSVD1) U15.A7(RSVD2) U15.B4(THERMALPAD) U15.C3(GND) U15.C6(RSVD3) U15.C7(Ground) U18.1 U19.1 U20.12(GND) U20.15(E#) U21.12(GND) U21.15(E#) U22.2(GND) USB.4 USB.5 USB.6 USB-C.1(EH) USB-C.2(EH) USB-C.3(EH) USB-C.4(EH) USB-C.A1B12(GND)
A0: ESP.6(IO2) MUX_RX.17(A0) MUX_TX.17(A0) R10.2 R20.2 U20.10(S0) U21.10(S0)
A1: ESP.7(IO3) MUX_RX.16(A1) MUX_TX.16(A1) R9.2 R21.2 U20.11(S1) U21.11(S1)
A2: ESP.8(IO4) MUX_RX.15(A2) MUX_TX.15(A2) R8.2 R18.2 U20.14(S2) U21.14(S2)
A3: ESP.9(IO5) MUX_RX.14(A3) MUX_TX.14(A3) R11.2 R17.2 U20.13(S3) U21.13(S3)
EN_MCU: C7.1 ESP.45(EN) MCU_RST.2 MCU_RST.4 R12.1
LPN: ESP.14(IO10) TOF_CONN.5
LPN_TOF: R1.2 TOF_CONN1.5 U15.A2(LPn)
RX0: CO0.2 MUX_RX.19(S1) U20.9(I0)
RX1: CO1.2 MUX_RX.20(S2) U20.8(I1)
RX2: CO2.2 MUX_RX.21(S3) U20.7(I2)
RX3: CO3.2 MUX_RX.22(S4) U20.6(I3)
RX4: CO4.2 MUX_RX.23(S5) U20.5(I4)
RX5: CO5.2 MUX_RX.24(S6) U20.4(I5)
RX6: CO6.2 MUX_RX.25(S7) U20.3(I6)
RX7: CO7.2 MUX_RX.26(S8) U20.2(I7)
RX8: CO8.2 MUX_RX.11(S9) U20.23(I8)
RX9: CO9.2 MUX_RX.10(S10) U20.22(I9)
RX10: MUX_RX.9(S11) U20.21(I10)
RX11: MUX_RX.8(S12) U20.20(I11)
RX12: MUX_RX.7(S13) U20.19(I12)
RX13: MUX_RX.6(S14) U20.18(I13)
RX14: MUX_RX.5(S15) U20.17(I14)
RX15: MUX_RX.4(S16) U20.16(I15)
RX_SIG: ESP.10(IO6) MUX_RX.28(D) R15.1 U20.1(COMMON_IN/OUT)
SCL: ESP.13(IO9) TOF_CONN.3
SCL_TOF: R3.2 TOF_CONN1.3 U15.A5(SCL/MCLK)
SDA: ESP.12(IO8) TOF_CONN.4
SDA_TOF: R2.2 TOF_CONN1.4 U15.A4(SDA/MOSI)
TOF_GPIO1: ESP.15(IO11) TOF_CONN.6
TOF_GPIO1_TOF: TOF_CONN1.6 U15.A1(GPIO1)
TOF_GPIO2: ESP.16(IO12) TOF_CONN.7
TOF_GPIO2_TOF: TOF_CONN1.7 U15.B1(GPIO2)
TX0: CO0.3 MUX_TX.19(S1) U21.9(I0)
TX1: CO1.3 MUX_TX.20(S2) U21.8(I1)
TX2: CO2.3 MUX_TX.21(S3) U21.7(I2)
TX3: CO3.3 MUX_TX.22(S4) U21.6(I3)
TX4: CO4.3 MUX_TX.23(S5) U21.5(I4)
TX5: CO5.3 MUX_TX.24(S6) U21.4(I5)
TX6: CO6.3 MUX_TX.25(S7) U21.3(I6)
TX7: CO7.3 MUX_TX.26(S8) U21.2(I7)
TX8: CO8.3 MUX_TX.11(S9) U21.23(I8)
TX9: CO9.3 MUX_TX.10(S10) U21.22(I9)
TX10: MUX_TX.9(S11) U21.21(I10)
TX11: MUX_TX.8(S12) U21.20(I11)
TX12: MUX_TX.7(S13) U21.19(I12)
TX13: MUX_TX.6(S14) U21.18(I13)
TX14: MUX_TX.5(S15) U21.17(I14)
TX15: MUX_TX.4(S16) U21.16(I15)
TX_SIG: ESP.11(IO7) MUX_TX.28(D) R16.1 U21.1(COMMON_IN/OUT)
USB_D_MINUS: ESP.23(IO19) U19.2 USB.3 USB-C.A7(DN1) USB-C.B7(DN2)
USB_D_PLUS: ESP.24(IO20) U18.2 USB.2 USB-C.A6(DP1) USB-C.B6(DP2)
$3N1694: R6.2 USB-C.A5(CC1)
$3N1724: R7.2 USB-C.B5(CC2)
$6N462: R4.1 U15.C2(NCS)
$6N468: R5.2 U15.C1(SPI_I2C_N)

Not connected (* = marked no-connect by the designer): 1V8 4(N/C)*; ESP 4(IO0) 5(IO1) 17(IO13) 18(IO14) 19(IO15) 20(IO16) 21(IO17) 22(IO18) 25(IO21) 26(IO26) 27(IO47) 28(IO33) 29(IO34) 30(IO48) 31(IO35) 32(IO36) 33(IO37) 34(IO38) 35(IO39) 36(IO40) 37(IO41) 38(IO42) 39(TXD0) 40(RXD0) 41(IO45) 44(IO46); MUX_RX 2(NC)* 3(NC)* 13(NC)*; MUX_TX 2(NC)* 3(NC)* 13(NC)*; U15 C5(MISO); U22 4(NC); USB-C A8(SBU1)* B1A12(GND) B8(SBU2)*

# Schematic Schematic2
Board Name: Board2; Create Date: 2025-11-10; Page Name: P1; Project Name: obstacleavoidanceunit; Schematic Name: Schematic2; Update Date: 2025-11-10; Company: EasyEDA.com; Page Size: A4; Version: V1.0
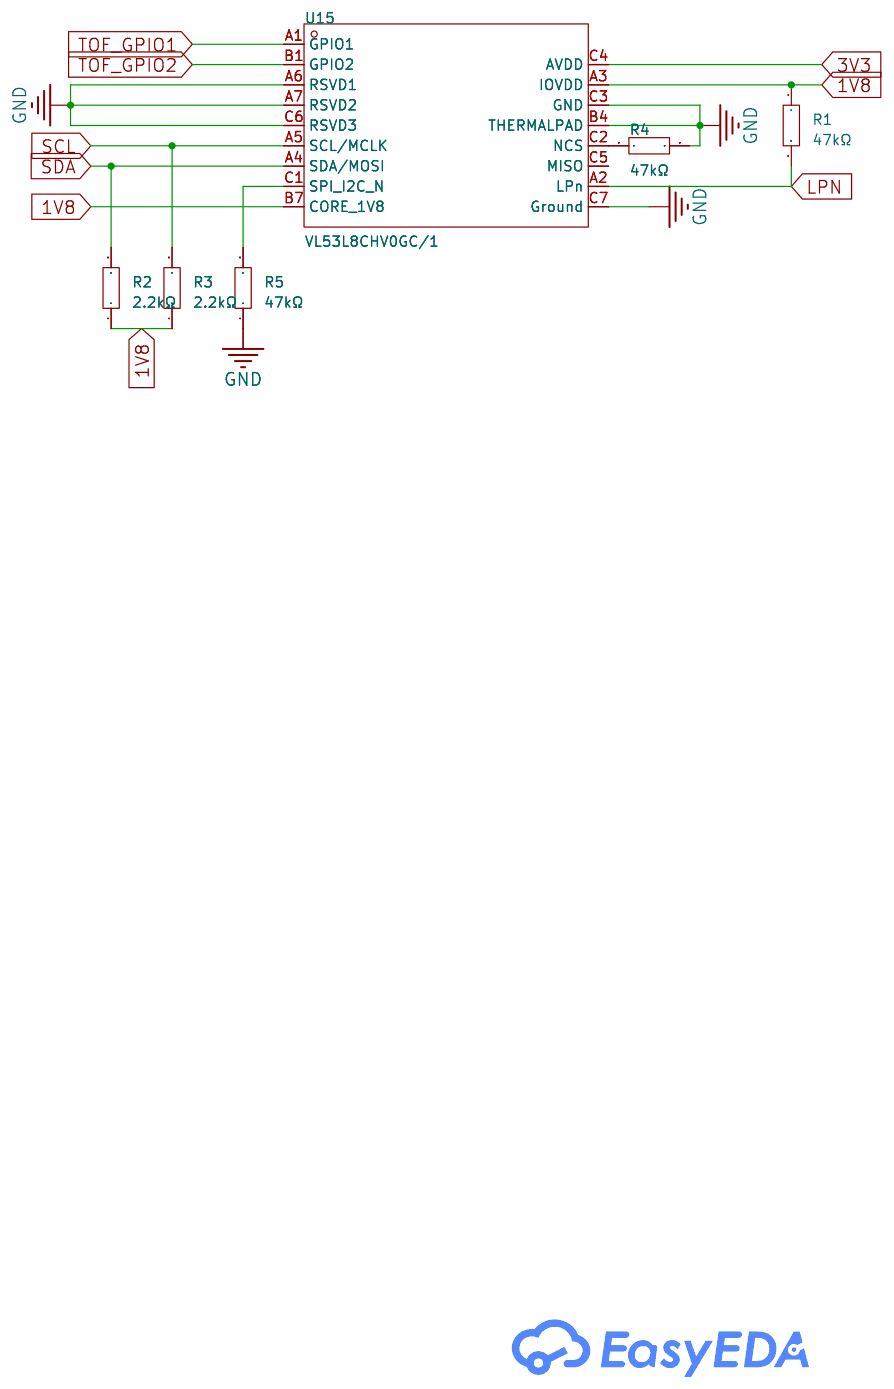
[diagram p5: schematic sheet]

## Parts
R1  47kΩ  [R0603]
R2  2.2kΩ  [R0603]
R3  2.2kΩ  [R0603]
R4  47kΩ  [R0603]
R5  47kΩ  [R0603]
U15  VL53L8CHV0GC/1  [LGA-16_L6.4-W3.0_VL53L5CXV0GC-1]

## Library data of the parts
R1 R4 R5 = 0603WAF4702T5E: Type:Thick Film Resistor Resistance:47kΩ Tolerance:±1% Tolerance:±1% Power(Watts):100mW Voltage-Supply(Max):75V Temperature Coefficient:±100ppm/℃ Temperature Coefficient:±100ppm/℃ Operating Temperature:-55℃~+155℃ Operating Temperature:-55℃~+155℃; LCSC Part Name: 47kΩ ±1% 100mW 厚膜电阻; Supplier Part: C25819; Manufacturer: UNI-ROYAL(厚声); Supplier Footprint: 0603; JLCPCB Part Class: Basic Part; Datasheet: https://item.szlcsc.com/datasheet/0603WAF4702T5E/26562.html; Supplier: LCSC; Type: Thick Film Resistor; Tolerance: ±1%; Power(Watts): 100mW; Voltage-Supply(Max): 75V; Temperature Coefficient: ±100ppm/℃; Operating Temperature: -55℃~+155℃
R2 R3 = 0603WAF2201T5E_C4190: Type:Thick Film Resistors Resistance:2.2kΩ Tolerance:±1% Tolerance:±1% Power(Watts): Overload Voltage (Max): Temperature Coefficient:±100ppm/℃ Temperature Coefficient:±100ppm/℃ Operating Temperature Range:-55℃~+155℃ Operating Temperature Range:-55℃~+155℃; LCSC Part Name: 2.2kΩ ±1% 100mW 厚膜电阻; Supplier Part: C4190; Manufacturer: UNI-ROYAL(厚声); Manufacturer Part: 0603WAF2201T5E; Supplier Footprint: 0603; JLCPCB Part Class: Basic Part; Datasheet: https://atta.szlcsc.com/upload/public/pdf/source/20200306/C422600_1E6D84923E4A46A82E41ADD87F860B5C.pdf; Supplier: LCSC; Type: Thick Film Resistors; Tolerance: ±1%; Temperature Coefficient: ±100ppm/℃; Operating Temperature Range: -55℃~+155℃
U15 = VL53L8CHV0GC/1: Supplier Part: C20033937; Manufacturer: ST(意法半导体); JLCPCB Part Class: Extended Part; Supplier: LCSC

## Nets
1V8: R1.1 R2.1 R3.1 U15.A3(IOVDD) U15.B7(CORE_1V8)
3V3: U15.C4(AVDD)
GND: R4.2 R5.1 U15.A6(RSVD1) U15.A7(RSVD2) U15.B4(THERMALPAD) U15.C3(GND) U15.C6(RSVD3) U15.C7(Ground)
LPN: R1.2 U15.A2(LPn)
SCL: R3.2 U15.A5(SCL/MCLK)
SDA: R2.2 U15.A4(SDA/MOSI)
TOF_GPIO1: U15.A1(GPIO1)
TOF_GPIO2: U15.B1(GPIO2)
Net-(R4-1): R4.1 U15.C2(NCS)
Net-(R5-2): R5.2 U15.C1(SPI_I2C_N)

Not connected (* = marked no-connect by the designer): U15 C5(MISO)

# Board PCB1
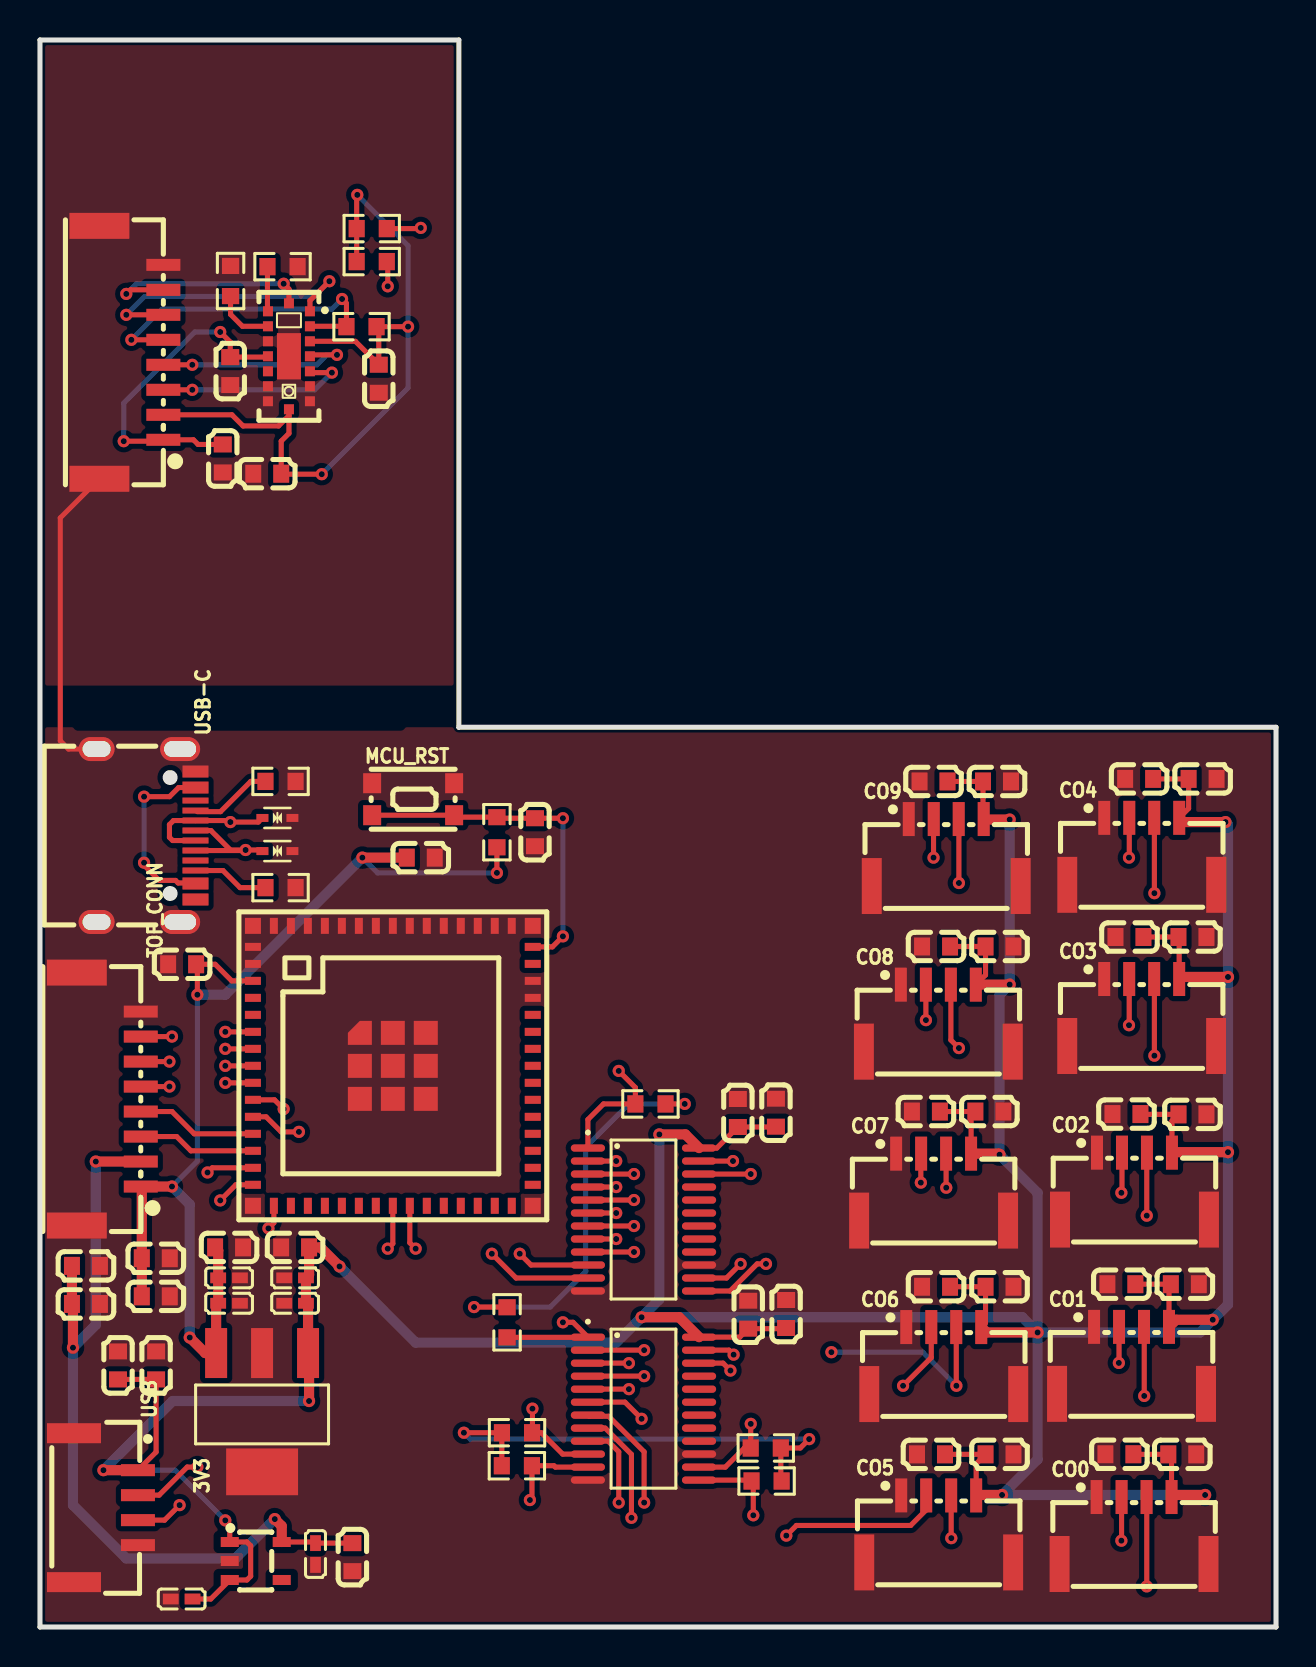
[diagram p6: board, top side]
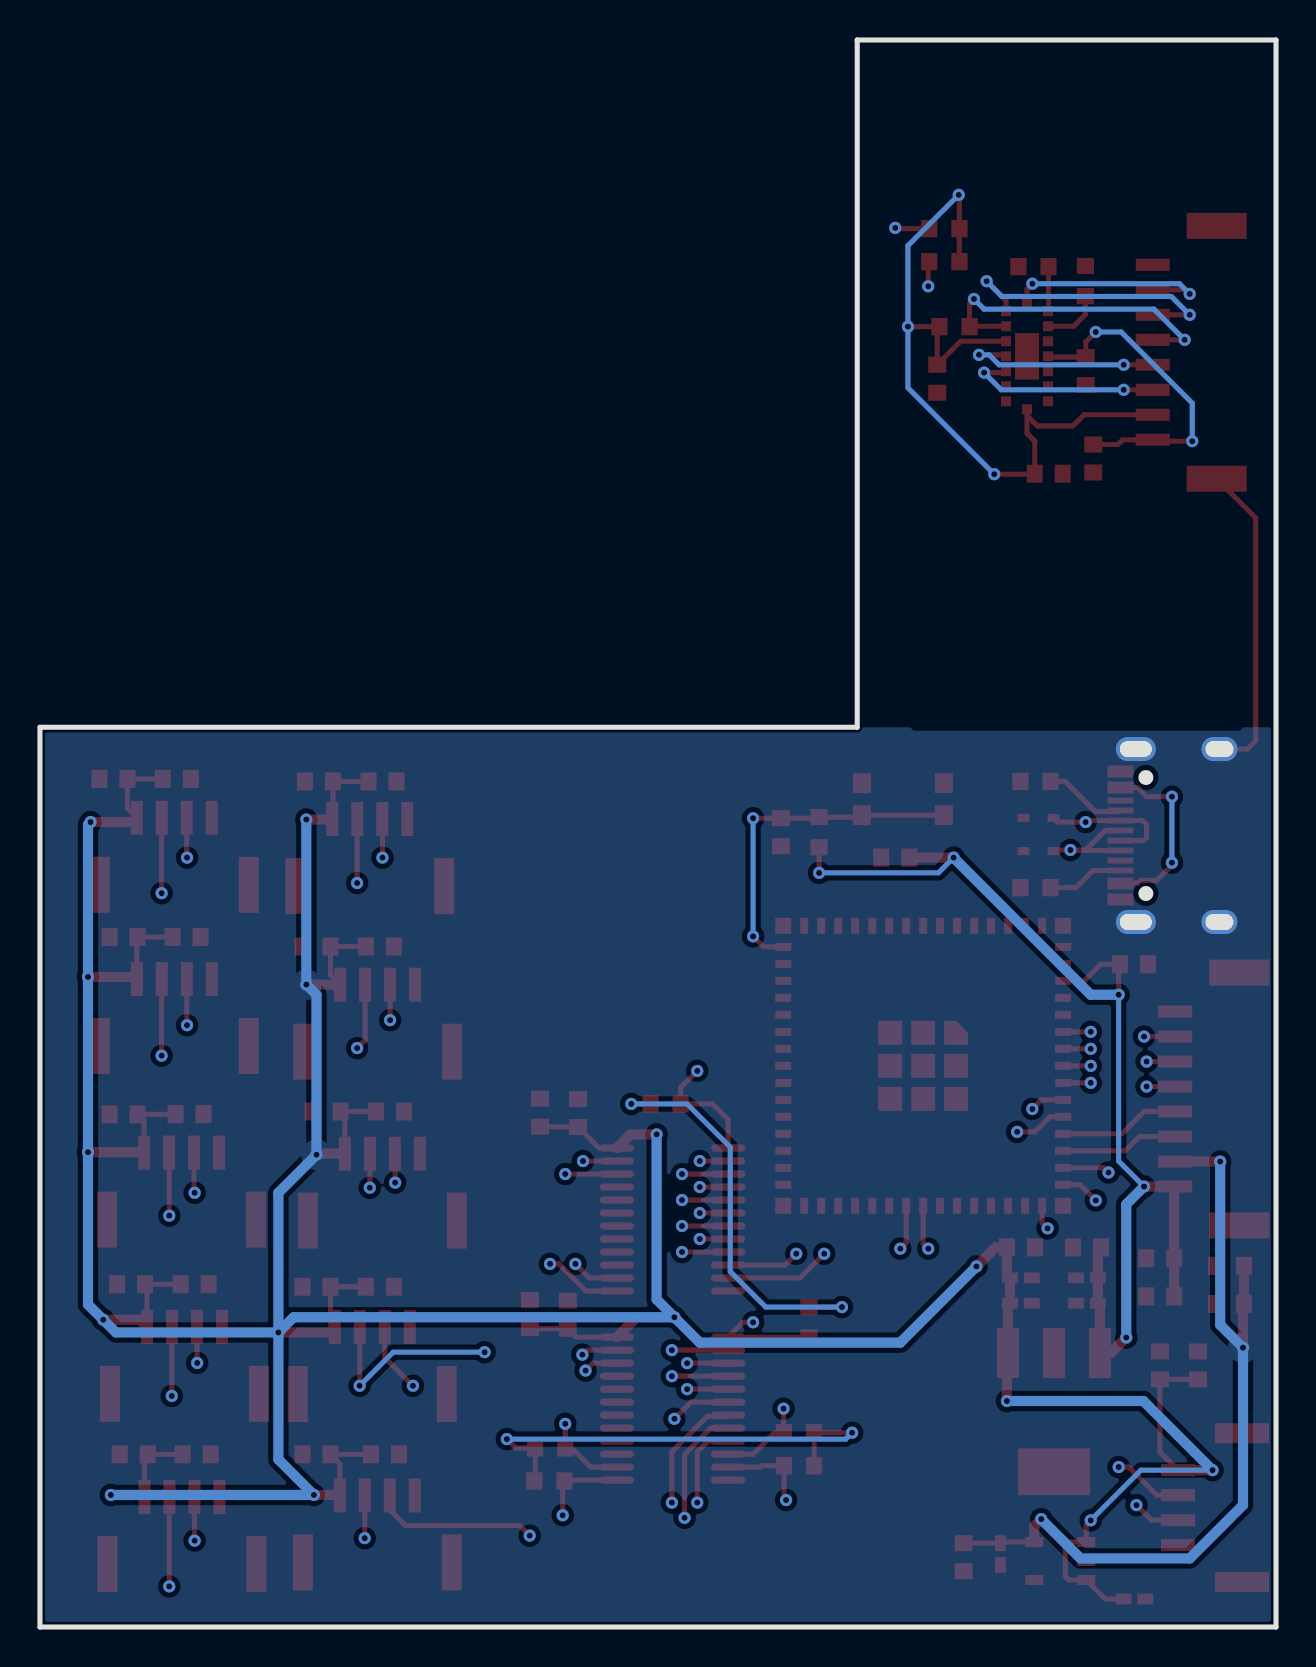
[diagram p7: board, bottom side, seen from below]

Outline 61.84 x 79.38 mm; copper layers: Top Layer, Inner1, Inner2, Bottom Layer. Coordinates in mm from the lower left corner of the outline.
Outline path: 0,79.38 20.96,79.38 20.96,45 61.84,45 61.84,0 0,0 0,79.38
Stack: Top Layer 0.035mm Outer layer copper thickness 1oz / Dielectric1 0.2104mm 7628 RC49% 8.6mil / Inner1 0.0152mm Inner layer copper thickness / Dielectric2 1.065mm 1.1mm H/HOZ Copper / Inner2 0.0152mm Inner layer copper thickness / Dielectric3 0.2104mm 7628 RC49% 8.6mil / Bottom Layer 0.035mm Outer layer copper thickness 1oz

## Design rules (mm)
template: Custom Config
spacing copperThickness1oz (default): track to track 0.102, other pairs 0.152 to 0.3
spacing copperThickness2oz: track to track 0.203, other pairs 0.152 to 0.3
track width copperThickness1oz (default): min 0.127, default 0.254, max 2.54
track width copperThickness2oz: min 0.203, default 0.254, max 2.54
differential pair differentialPair (default): width min 0.127, default 0.254, max 2.54; gap min 0.152, default 0.152
via viaSize (default): diameter min 0.5, default 0.61, max 10; hole min 0.3, default 0.305, max 6.3

## Placement (name value [footprint] x y rotation side)
3V3  H7650-35GR  [SOT-223-3_L6.5-W3.4-P2.30-LS7.0-BR]  11.11 10.73 90 top
C1  100nF  [C0402]  12.76 17.46 0 top
C2  100pF  [C0402]  12.76 16.19 0 top
C3  100pF  [C0402]  9.46 16.19 180 top
C4  100nF  [C0402]  9.46 17.46 180 top
C7  1uF  [C0603]  24.76 39.75 270 top
C8  10uF  [C0603]  7.11 33.15 0 top
C9  100nF  [C0603]  19.05 38.48 180 top
C10  100nF  [C0603]  5.81 13.08 90 top
C11  1uF  [C0603]  3.9 13.08 90 top
C28  1uF  [C0603]  57.15 8.64 0 top
C29  100nF  [C0603]  54 8.64 180 top
C34  10uF  [C0402]  7.09 1.4 0 top
C35  1uF  [C0603]  15.63 3.5 90 top
C48  1uF  [C0603]  12.76 18.99 0 top
C49  1uF  [C0603]  9.46 18.99 180 top
C51  1uF  [C0603]  5.79 16.54 0 top
C52  100nF  [C0603]  5.79 18.44 0 top
C53  1uF  [C0603]  2.3 16.16 0 top
C54  100nF  [C0603]  2.3 18.06 0 top
C55  1uF  [C0603]  9.52 62.81 270 top
C56  100nF  [C0603]  9.15 58.45 270 top
C57  1uF  [C0603]  16.95 62.43 270 top
C58  100nF  [C0603]  11.37 57.68 180 top
C59  1uF  [C0603]  54.1 17.14 180 top
C60  100nF  [C0603]  57.28 17.14 0 top
C61  1uF  [C0603]  54.36 25.65 180 top
C62  100nF  [C0603]  57.66 25.64 0 top
C63  1uF  [C0603]  44.32 25.78 180 top
C64  100nF  [C0603]  47.5 25.78 0 top
C65  1uF  [C0603]  44.83 17.02 180 top
C66  100nF  [C0603]  48.01 17.02 0 top
C67  1uF  [C0603]  44.58 8.64 180 top
C68  100nF  [C0603]  48.01 8.64 0 top
C69  1uF  [C0603]  44.7 42.29 180 top
C70  100nF  [C0603]  47.88 42.29 0 top
C71  1uF  [C0603]  44.83 34.04 180 top
C72  100nF  [C0603]  48.01 34.04 0 top
C73  1uF  [C0603]  54.51 34.51 180 top
C74  100nF  [C0603]  57.66 34.51 0 top
C75  1uF  [C0603]  54.99 42.42 180 top
C76  100nF  [C0603]  58.17 42.42 0 top
C77  100nF  [C0402]  13.78 3.65 90 top
C78  1uF  [C0603]  34.91 25.71 90 top
C79  100nF  [C0603]  36.82 25.72 90 top
C80  1uF  [C0603]  37.33 15.66 90 top
C81  100nF  [C0603]  35.43 15.62 90 top
CO0  WAFER-GH1.25-4PLB  [CONN-SMD_4P-P1.25_XUNPU_WAFER-GH1.25-4PLB]  54.74 4.83 0 top
CO1  WAFER-GH1.25-4PLB  [CONN-SMD_4P-P1.25_XUNPU_WAFER-GH1.25-4PLB]  54.61 13.33 0 top
CO2  WAFER-GH1.25-4PLB  [CONN-SMD_4P-P1.25_XUNPU_WAFER-GH1.25-4PLB]  54.76 22.05 0 top
CO3  WAFER-GH1.25-4PLB  [CONN-SMD_4P-P1.25_XUNPU_WAFER-GH1.25-4PLB]  55.12 30.73 0 top
CO4  WAFER-GH1.25-4PLB  [CONN-SMD_4P-P1.25_XUNPU_WAFER-GH1.25-4PLB]  55.12 38.8 0 top
CO5  WAFER-GH1.25-4PLB  [CONN-SMD_4P-P1.25_XUNPU_WAFER-GH1.25-4PLB]  44.96 4.91 0 top
CO6  WAFER-GH1.25-4PLB  [CONN-SMD_4P-P1.25_XUNPU_WAFER-GH1.25-4PLB]  45.22 13.33 0 top
CO7  WAFER-GH1.25-4PLB  [CONN-SMD_4P-P1.25_XUNPU_WAFER-GH1.25-4PLB]  44.71 22 0 top
CO8  WAFER-GH1.25-4PLB  [CONN-SMD_4P-P1.25_XUNPU_WAFER-GH1.25-4PLB]  44.95 30.45 0 top
CO9  WAFER-GH1.25-4PLB  [CONN-SMD_4P-P1.25_XUNPU_WAFER-GH1.25-4PLB]  45.34 38.73 0 top
ESP  2.4GHz  [BULETM-SMD_ESPRESSIF_ESP32-S3-MINI-1U-N8]  17.65 28.07 0 top
MCU_RST  KMR211NGLFS  [SW-SMD_4P-L4.2-W2.8-P1.60-LS4.6-TR]  18.67 41.4 0 top
R1  47kΩ  [R0603]  16.09 65.04 180 top
R2  2.2kΩ  [R0603]  16.6 68.29 0 top
R3  2.2kΩ  [R0603]  16.6 69.94 0 top
R4  47kΩ  [R0603]  9.53 67.32 90 top
R5  47kΩ  [R0603]  12.13 68.04 180 top
R6  5.1kΩ  [R0603]  12.04 42.29 180 top
R7  5.1kΩ  [R0603]  12.04 36.98 180 top
R12  10kΩ  [R0603]  22.86 39.75 270 top
R15  2.2kΩ  [R0603]  30.54 26.16 0 top
R16  2.2kΩ  [R0603]  23.37 15.24 90 top
R17  4.7kΩ  [R0603]  36.35 7.3 180 top
R18  4.7kΩ  [R0603]  36.31 8.95 180 top
R20  4.7kΩ  [R0603]  23.87 9.72 0 top
R21  4.7kΩ  [R0603]  23.86 8.07 0 top
TOF_CONN  A1257WR-S-8P  [CONN-SMD_A1257WR-S-8P]  3.44 26.41 270 top
TOF_CONN1  A1257WR-S-8P  [CONN-SMD_A1257WR-S-8P]  4.57 63.75 270 top
U15  VL53L8CHV0GC/1  [LGA-16_L6.4-W3.0_VL53L5CXV0GC-1]  12.46 63.56 90 top
U18  ESD5B5.0ST1G-ES  [SOD-523_L1.2-W0.8-LS1.6-BI]  11.88 38.81 180 top
U19  ESD5B5.0ST1G-ES  [SOD-523_L1.2-W0.8-LS1.6-BI]  11.88 40.47 180 top
U20  CD4067BMT/TR  [TSSOP-24_L7.8-W4.4-P0.65-LS6.4-BL_1]  30.19 20.38 270 top
U21  CD4067BMT/TR  [TSSOP-24_L7.8-W4.4-P0.65-LS6.4-BL_1]  30.19 10.92 270 top
U22  AP2112K-1.8TRG1  [SOT-25_L3.0-W1.6-P0.95-LS2.8-BL]  10.79 3.3 270 top
USB  SM04B-GHS-TB(LF)(SN)  [CONN-SMD_4P-P1.25_SM04B-GHS-TB-LF-SN]  3.3 5.97 270 top
USB-C  TYPE-C-31-M-12  [USB-C_SMD-TYPE-C-31-M-12_1]  5.31 39.59 270 top

## Footprints (pads in the part's own frame, mm; a bottom-side part is the same pattern mirrored in y, then rotated)
BULETM-SMD_ESPRESSIF_ESP32-S3-MINI-1U-N8
  rect 0.8x0.4 smd: 1(-7,5.95) 2(-7,5.1) 3(-7,4.25) 4(-7,3.4) 5(-7,2.55) 6(-7,1.7) 7(-7,0.85) 8(-7,0) 9(-7,-0.85) 10(-7,-1.7) 11(-7,-2.55) 12(-7,-3.4) 13(-7,-4.25) 14(-7,-5.1) 15(-7,-5.95) 31(7,-5.95) 32(7,-5.1) 33(7,-4.25) 34(7,-3.4) 35(7,-2.55) 36(7,-1.7) 37(7,-0.85) 38(7,0) 39(7,0.85) 40(7,1.7) 41(7,2.55) 42(7,3.4) 43(7,4.25) 44(7,5.1) 45(7,5.95)
  rect 0.4x0.8 smd: 16(-5.95,-7) 17(-5.1,-7) 18(-4.25,-7) 19(-3.4,-7) 20(-2.55,-7) 21(-1.7,-7) 22(-0.85,-7) 23(0,-7) 24(0.85,-7) 25(1.7,-7) 26(2.55,-7) 27(3.4,-7) 28(4.25,-7) 29(5.1,-7) 30(5.95,-7) 46(5.95,7) 47(5.1,7) 48(4.25,7) 49(3.4,7) 50(2.55,7) 51(1.7,7) 52(0.85,7) 53(0,7) 54(-0.85,7) 55(-1.7,7) 56(-2.55,7) 57(-3.4,7) 58(-4.25,7) 59(-5.1,7) 60(-5.95,7)
  custom 1.2x1.2 smd: 61(-1.65,1.65)
  rect 1.2x1.2 smd: 61(-1.65,0) 61(-1.65,-1.65) 61(0,1.65) 61(0,0) 61(0,-1.65) 61(1.65,1.65) 61(1.65,0) 61(1.65,-1.65)
  rect 0.8x0.8 smd: 62(-7,7) 63(-7,-7) 64(7,-7) 65(7,7)
C0402
  rect 0.79x0.54 smd: 1(-0.545,0) 2(0.545,0)
C0603
  rect 0.8x0.9 smd: 1(-0.7,0) 2(0.7,0)
CONN-SMD_4P-P1.25_SM04B-GHS-TB-LF-SN
  rect 0.6x1.7 smd: 1(-1.875,1.599) 2(-0.625,1.599) 3(0.625,1.599) 4(1.875,1.599)
  rect 1x2.7 smd: 5(3.724,-1.599) 6(-3.724,-1.599)
CONN-SMD_4P-P1.25_XUNPU_WAFER-GH1.25-4PLB
  rect 0.6x1.7 smd: 1(-1.875,1.675) 2(-0.625,1.675) 3(0.625,1.675) 4(1.875,1.675)
  rect 1x2.8 smd: 5(-3.725,-1.675) 6(3.725,-1.675)
CONN-SMD_A1257WR-S-8P
  rect 0.6x1.7 smd: 1(4.375,1.6) 2(3.125,1.6) 3(1.875,1.6) 4(0.625,1.6) 5(-0.625,1.6) 6(-1.875,1.6) 7(-3.126,1.6) 8(-4.375,1.6)
  rect 1.3x3 smd: 9(6.325,-1.6) 10(-6.325,-1.6)
LGA-16_L6.4-W3.0_VL53L5CXV0GC-1
  rect 0.5x0.5 smd: A1(2.25,-1.05) A2(1.5,-1.05) A3(0.75,-1.05) A4(0,-1.05) A5(-0.75,-1.05) A6(-1.5,-1.05) A7(-2.25,-1.05) B1(2.65,0) B7(-2.65,0) C1(2.25,1.05) C2(1.5,1.05) C3(0.75,1.05) C4(0,1.05) C5(-0.75,1.05) C6(-1.5,1.05) C7(-2.25,1.05)
  rect 2.316x1.2 smd: B4(0,0)
R0603
  rect 0.806x0.864 smd: 1(-0.753,0) 2(0.753,0)
SOD-523_L1.2-W0.8-LS1.6-BI
  rect 0.6x0.4 smd: 1(-0.75,0) 2(0.75,0)
SOT-25_L3.0-W1.6-P0.95-LS2.8-BL
  rect 0.5x0.9 smd: 1(-0.95,-1.3) 2(0,-1.3) 3(0.95,-1.3) 4(0.95,1.3) 5(-0.95,1.3)
SOT-223-3_L6.5-W3.4-P2.30-LS7.0-BR
  rect 2.5x1.1 smd: 1(2.97,-2.3) 2(2.97,0) 3(2.97,2.3)
  rect 2.34x3.6 smd: 4(-2.97,0)
SW-SMD_4P-L4.2-W2.8-P1.60-LS4.6-TR
  rect 0.9x1 smd: 1(2.05,0.8) 2(2.05,-0.8) 3(-2.05,0.8) 4(-2.05,-0.8)
TSSOP-24_L7.8-W4.4-P0.65-LS6.4-BL_1
  oval 0.364x1.71 smd: 1(-3.575,-2.78) 2(-2.925,-2.78) 3(-2.275,-2.78) 4(-1.625,-2.78) 5(-0.975,-2.78) 6(-0.325,-2.78) 7(0.325,-2.78) 8(0.975,-2.78) 9(1.625,-2.78) 10(2.275,-2.78) 11(2.925,-2.78) 12(3.575,-2.78) 13(3.575,2.78) 14(2.925,2.78) 15(2.275,2.78) 16(1.625,2.78) 17(0.975,2.78) 18(0.325,2.78) 19(-0.325,2.78) 20(-0.975,2.78) 21(-1.625,2.78) 22(-2.275,2.78) 23(-2.925,2.78) 24(-3.575,2.78)
USB-C_SMD-TYPE-C-31-M-12_1
  oval 1.2x2 hole 0.8x1.6: 1(4.325,1.706) 4(-4.325,1.706)
  oval 1.2x1.8 hole 0.8x1.4: 2(4.325,-2.474) 3(-4.325,-2.474)
  custom 0.6x1.3 smd: A1B12(-3.2,2.474) A4B9(-2.4,2.474) B1A12(3.2,2.474) B4A9(2.401,2.474)
  rect 0.3x1.3 smd: A5(-1.25,2.474) A6(-0.25,2.474) A7(0.25,2.474) A8(1.25,2.474) B5(1.75,2.474) B6(0.75,2.474) B7(-0.75,2.474) B8(-1.75,2.474)

## Nets
As in the schematic.

Pads without a net: ESP 4 5 17 18 19 20 21 22 25 26 27 28 29 30 31 32 33 34 35 36 37 38 39 40 41 44; U15 C5; U22 4; USB-C A8 B1A12 B8

## Via types
v1: diameter 0.61, hole 0.305, Top Layer to Bottom Layer, 118 vias

## Routing (per net, layer and track width the routed paths; a pad name or vN(x,y) marks a point on that pad's centre or on a via; arc(x,y) is an arc through that point)
+1V8: length 40.9
  Top Layer w0.254: C35.2 C77.2 13.73,4.25 U22.5
  Top Layer w0.508: C54.1 C53.1 1.65,16.11 v1(1.65,13.97) ; U22.5 12.09,5.05 v1(11.75,5.4) ; 5.04,23.28 v1(2.79,23.28)
  Bottom Layer w0.508: v1(11.75,5.4) 9.78,3.43 4.32,3.43 1.65,6.1 v1(1.65,13.97) 2.79,15.11 v1(2.79,23.28)
+1V8_TOF: length 39.8
  Top Layer w0.254: v1(18.41,65.04) R1.1 16.95,64.93 C57.1 15.78,64.31 U15.A3 ; 12.46,60.59 U15.B7 ; 12.46,60.59 12.46,59.7 12.07,59.31 C58.1 12.09,57.66 v1(14.1,57.66) ; 12.46,60.59 11.94,60.07 10.16,60.07 9.6,60.63 TOF_CONN1.2 ; v1(15.88,71.63) 15.84,71.6 R3.1 R2.1
  Bottom Layer w0.254: v1(15.88,71.63) 18.41,69.09 v1(18.41,65.04) 18.41,61.98 v1(14.1,57.66)
+3V3: length 125
  Top Layer w0.254: ESP.3 9.59,32.32 8.76,33.15 C8.2 7.87,33.08 v1(7.87,31.62) ; v1(38.48,9.4) 38.04,8.95 R18.1 37.06,7.34 37.1,7.3 ; v1(21.72,16) 23.36,16 R16.2 ; R12.2 v1(22.86,37.72) ; 31.29,26.16 v1(32.26,26.16) ; v1(21.21,9.72) R20.1 23.11,9.71 R21.1
  Top Layer w0.508: 8.76,18.99 8.92,18.83 C4.2 C3.2 8.81,16.09 3V3.3 8.27,13.7 v1(7.49,14.48) ; v1(6.6,22.03) 5.04,22.03 5.09,21.98 C52.1 C51.1 ; C9.2 v1(16.13,38.48)
  Inner2 w0.254: v1(21.21,9.72) 21.21,12.19 21.72,12.7 21.72,15.75 21.59,15.88
  Inner2 w0.508: v1(21.72,16) 20.19,14.48 v1(7.49,14.48)
  Bottom Layer w0.254: v1(6.6,22.03) 7.87,23.3 v1(7.87,31.62) ; v1(32.26,26.16) 29.46,26.16 27.31,24 27.31,17.78 25.53,16 v1(21.72,16) ; v1(21.21,9.72) 21.53,9.4 v1(38.48,9.4) ; v1(16.13,38.48) 16.89,37.72 v1(22.86,37.72)
  Bottom Layer w0.508: v1(16.13,38.48) 9.27,31.62 v1(7.87,31.62) ; v1(6.6,22.03) 7.49,21.14 v1(7.49,14.48)
+3V3_TOF: length 16.7
  Top Layer w0.254: C56.1 7.91,59.15 7.68,59.38 TOF_CONN1.1 6.1,59.31 v1(4.19,59.31) ; v1(9.02,64.77) 9.52,64.27 C55.1 11.37,63.52 U15.C4
  Bottom Layer w0.254: v1(9.02,64.77) 7.75,64.77 4.19,61.21 v1(4.19,59.31)
+5V: length 282.9
  Top Layer w0.254: C75.1 C76.1 57.47,40.94 57,40.47 ; C59.1 C60.1 56.49,17.05 CO1.4 ; U21.24 35.01,14.5 C81.1 37.29,14.92 C80.1 ; C67.1 C68.1 46.84,8.17 46.84,6.58 ; 45.53,17.02 C66.1 47.31,15.22 CO6.4 ; C69.1 C70.1 47.18,40.44 ; C63.1 C64.1 46.58,25.57 CO7.4 ; 54.7,8.64 54.71,8.64 C28.1 56.61,8.47 CO0.4 ; CO3.4 56.99,34.48 C74.1 C73.1 ; USB-C.B4A9 7.65,37.19 7.63,37.21 6.91,37.21 6.78,37.34 5.97,37.34 5.21,38.1 v1(5.21,38.23) ; USB-C.A4B9 6.94,41.99 6.48,41.53 v1(5.21,41.53) ; USB.1 5.81,8.75 C10.1 C11.1 ; 45.53,34.04 C72.1 47.31,32.61 46.82,32.13 ; C79.1 36.81,25.01 C78.1 33.86,23.96 U20.24 ; CO2.4 56.63,25.31 C62.1 55.07,25.64 C61.1 ; v1(9.27,5.33) 9.5,5.11 9.5,4.25 10.35,4.25 10.54,4.06 10.54,2.54 10.35,2.35 9.5,2.35 8.54,1.4 C34.2
  Top Layer w0.508: v1(30.99,24.64) 32.29,24.64 U20.24 ; v1(59.44,32.51) 57.1,32.51 CO3.4 ; v1(59.44,23.75) 56.66,23.75 CO2.4 ; v1(49.91,14.73) 47.36,14.73 CO6.4 ; USB.1 v1(3.17,7.84) ; v1(48.13,6.6) 46.86,6.6 46.84,6.58 ; CO7.4 47.95,23.68 v1(48.01,23.62) ; v1(58.67,15.37) 56.84,15.37 CO1.4 ; CO0.4 56.72,6.6 v1(58.29,6.6) ; v1(59.31,40.26) 57.21,40.26 57,40.47 ; v1(48.51,32.13) 46.82,32.13 46.82,32.13 ; CO9.4 47.24,40.39 v1(48.51,40.39) ; U21.24 31.98,15.49 v1(30.1,15.49) ; v1(14.99,18.03) 14.03,18.99 C48.2 13.46,17.62 C1.2 C2.2 13.41,16.09 3V3.1 13.46,13.65 v1(13.46,11.3)
  Inner1 w0.508: v1(14.99,18.03) 7.75,18.03 5.21,20.57 v1(5.21,38.23)
  Bottom Layer w0.254: v1(5.21,38.23) v1(5.21,41.53) ; v1(9.27,5.33) 6.76,7.84 v1(3.17,7.84)
  Bottom Layer w0.508: v1(49.91,14.73) 49.91,21.72 v1(48.01,23.62) 48.01,31.62 v1(48.51,32.13) v1(48.51,40.39) ; v1(49.91,14.73) 58.04,14.73 v1(58.67,15.37) 59.44,16.13 v1(59.44,23.75) v1(59.44,32.51) 59.44,40.13 v1(59.31,40.26) ; v1(49.91,14.73) 49.91,8.38 v1(48.13,6.6) v1(58.29,6.6) ; v1(49.91,14.73) 49.15,15.49 v1(30.1,15.49) ; v1(3.17,7.84) 6.63,11.3 v1(13.46,11.3) ; v1(30.1,15.49) 28.83,14.22 18.8,14.22 v1(14.99,18.03) ; v1(30.1,15.49) 30.99,16.38 v1(30.99,24.64)
GND: length 15.9
  Top Layer w0.254: TOF_CONN1.9 1.02,55.47 1.02,44.32 1.43,43.91 USB-C.3
A0: length 36.8
  Top Layer w0.254: U20.10 24.57,18.11 v1(24,18.67) ; U21.10 26.15,8.65 25.08,9.72 R20.2 24.64,9.74 v1(24.64,10.92) ; ESP.6 v1(9.27,29.77)
  Inner1 w0.254: v1(9.27,29.77) 12.91,29.77 v1(24,18.67)
  Inner2 w0.254: v1(24.64,10.92) 24.64,18.03 v1(24,18.67)
A1: length 42
  Top Layer w0.254: U20.11 23.82,17.46 v1(22.61,18.67) ; U21.11 25.78,8 25.72,8.07 R21.2 24.61,6.45 v1(24.51,6.35) ; ESP.7 v1(9.27,28.92)
  Inner1 w0.254: v1(9.27,28.92) 12.36,28.92 v1(22.61,18.67)
  Inner2 w0.254: v1(24.51,6.35) 23.62,7.24 23.62,17.65 v1(22.61,18.67)
A2: length 46.3
  Top Layer w0.254: U20.14 34.35,17.46 v1(35.05,18.16) ; v1(35.56,10.16) 35.56,10.16 R18.2 35.24,8.95 34.29,8 U21.14 ; ESP.8 v1(9.27,28.07)
  Inner1 w0.254: v1(35.05,18.16) 34.77,17.88 22,17.88 11.81,28.07 v1(9.27,28.07)
  Inner2 w0.254: v1(35.05,18.16) 35.56,17.65 v1(35.56,10.16)
A3: length 54.1
  Top Layer w0.254: U20.13 34.52,16.81 35.88,18.16 v1(36.32,18.16) ; v1(35.69,5.59) 35.69,7.22 R17.2 35.56,7.35 U21.13 ; ESP.9 v1(9.27,27.22)
  Inner1 w0.254: v1(36.32,18.16) 35.43,17.27 33.4,17.27 33.15,17.53 21.85,17.53 12.16,27.22 v1(9.27,27.22)
  Inner2 w0.254: v1(35.69,5.59) 36.32,6.22 v1(36.32,18.16)
EN_MCU: length 17.2
  Top Layer w0.254: v1(26.16,34.54) 25.63,34.02 ESP.45 ; MCU_RST.4 MCU_RST.2 20.82,40.5 R12.1 22.91,40.45 C7.1 v1(26.16,40.45)
  Bottom Layer w0.254: v1(26.16,40.45) v1(26.16,34.54)
LPN: length 8.9
  Top Layer w0.254: 5.04,27.03 v1(6.48,27.03) ; ESP.14 8.62,22.97 v1(8.38,22.73)
  Inner1 w0.254: v1(6.48,27.03) 8.38,25.12 v1(8.38,22.73)
LPN_TOF: length 16.3
  Top Layer w0.254: TOF_CONN1.5 v1(4.57,64.38) ; U15.A2 15.31,65.06 R1.2 15.33,66.2 v1(15.11,66.42)
  Bottom Layer w0.254: v1(15.11,66.42) 14.6,65.91 6.11,65.91 v1(4.57,64.38)
RX0: length 34.9
  Top Layer w0.254: CO0.2 54.11,4.33 v1(54.1,4.32) ; U20.9 v1(29.72,18.76)
  Inner2 w0.254: v1(54.1,4.32) 51.82,4.32 37.38,18.76 v1(29.72,18.76)
RX1: length 30.9
  Top Layer w0.254: U20.8 v1(28.83,19.41) ; CO1.2 53.99,13.22 v1(53.97,13.21)
  Inner2 w0.254: v1(53.97,13.21) 43.43,13.21 38.48,18.16 38.48,18.16 37.53,19.11 30.61,19.11 30.31,19.41 v1(28.83,19.41)
RX2: length 29.4
  Top Layer w0.254: v1(54.1,21.72) 54.13,21.75 CO2.2 ; U20.7 v1(29.72,20.06)
  Inner2 w0.254: v1(29.72,20.06) 52.44,20.06 v1(54.1,21.72)
RX3: length 36.6
  Top Layer w0.254: CO3.2 54.49,30.11 v1(54.48,30.1) ; U20.6 v1(28.83,20.71)
  Inner2 w0.254: v1(54.48,30.1) 54.48,24.38 50.8,20.71 v1(28.83,20.71)
RX4: length 43.2
  Top Layer w0.254: v1(54.48,38.48) 54.5,38.5 CO4.2 ; U20.5 v1(29.72,21.36)
  Inner2 w0.254: v1(29.72,21.36) 49.3,21.36 52.71,24.77 52.71,36.7 v1(54.48,38.48)
RX5: length 32.7
  Top Layer w0.254: U20.4 v1(28.83,22.01) ; CO5.2 44.34,5.86 43.56,5.08 37.85,5.08 v1(37.34,4.57)
  Inner2 w0.254: v1(37.34,4.57) 34.93,4.57 28.07,11.43 28.07,21.24 v1(28.83,22.01)
RX6: length 42.3
  Top Layer w0.254: U20.3 v1(29.72,22.66) ; CO6.2 44.59,13.48 v1(43.18,12.06)
  Inner2 w0.254: v1(43.18,12.06) 43.18,9.53 37.59,3.94 34.8,3.94 27.71,11.02 27.71,22 28.37,22.66 v1(29.72,22.66)
RX7: length 19
  Top Layer w0.254: v1(44.07,22.22) 44.07,23.66 CO7.2 ; U20.2 v1(28.83,23.31)
  Inner2 w0.254: v1(28.83,23.31) 30.03,23.31 31.63,21.71 43.56,21.71 v1(44.07,22.22)
RX8: length 17.2
  Top Layer w0.254: U20.23 v1(34.67,23.31) ; CO8.2 44.32,30.35
  Inner2 w0.254: v1(34.67,23.31) 39.31,23.31 44.32,28.32 v1(44.32,30.35)
RX9: length 26.6
  Top Layer w0.254: U20.22 v1(35.56,22.66) ; CO9.2 44.7,40.4 v1(44.7,38.48)
  Inner2 w0.254: v1(44.7,38.48) 45.09,38.1 45.09,28.58 39.16,22.66 v1(35.56,22.66)
RX_SIG: length 30.2
  Top Layer w0.254: U20.1 27.41,25.38 28.19,26.16 R15.1 29.79,26.98 v1(28.96,27.81) ; 10.65,26.37 11.73,26.37 v1(12.19,25.91)
  Inner2 w0.254: v1(12.19,25.91) 13.46,25.91 18.03,21.34 24.13,21.34 28.96,26.16 v1(28.96,27.81)
SCL: length 5.9
  Top Layer w0.254: 5.04,24.53 6.84,24.53 7.55,23.82 ESP.13
SCL_TOF: length 21.1
  Top Layer w0.254: v1(14.6,62.74) 13.57,62.74 13.51,62.81 ; 17.35,69.94 19.02,69.94 v1(19.05,69.98) ; TOF_CONN1.3 v1(7.62,61.88)
  Inner1 w0.254: v1(14.6,62.74) 15.24,62.74 19.05,66.55 v1(19.05,69.98)
  Bottom Layer w0.254: v1(14.6,62.74) 13.75,61.88 v1(7.62,61.88)
SDA: length 6.1
  Top Layer w0.254: 5.04,25.78 6.6,25.78 7.72,24.67 10.65,24.67
SDA_TOF: length 16
  Top Layer w0.254: U15.A4 13.58,63.63 v1(14.86,63.63) ; 17.35,68.29 17.4,68.24 v1(17.4,67.06) ; TOF_CONN1.4 v1(7.62,63.13)
  Inner1 w0.254: v1(17.4,67.06) 17.4,66.17 v1(14.86,63.63)
  Bottom Layer w0.254: v1(7.62,63.13) 13.85,63.13 14.35,63.63 v1(14.86,63.63)
TOF_GPIO1: length 11.4
  Top Layer w0.254: 5.04,28.28 v1(6.48,28.28) ; v1(9.02,21.34) 9.8,22.12 ESP.15
  Inner1 w0.254: v1(9.02,21.34) 9.02,25.74 v1(6.48,28.28)
TOF_GPIO1_TOF: length 14.6
  Top Layer w0.254: TOF_CONN1.6 v1(4.32,65.63) ; 13.51,65.81 13.51,66.34 v1(14.48,67.31)
  Bottom Layer w0.254: v1(14.48,67.31) 13.72,66.55 5.24,66.55 v1(4.32,65.63)
TOF_GPIO2: length 14.4
  Top Layer w0.254: ESP.16 11.7,20.21 v1(11.43,19.94) ; 5.04,29.53 v1(6.6,29.53)
  Inner1 w0.254: v1(6.6,29.53) 6.6,28.98 9.37,26.21 9.37,22 v1(11.43,19.94)
TOF_GPIO2_TOF: length 11.1
  Top Layer w0.254: v1(4.32,66.67) 4.52,66.88 TOF_CONN1.7 ; U15.B1 12.46,66.92 v1(12.19,67.18)
  Bottom Layer w0.254: v1(4.32,66.67) 4.83,67.18 v1(12.19,67.18)
TX0: length 38
  Top Layer w0.254: v1(28.96,6.22) 28.96,8.76 28.42,9.3 U21.9 ; CO0.3 55.37,6.49 v1(55.37,2.03)
  Inner2 w0.254: v1(28.96,6.22) 28.96,4.32 31.24,2.03 v1(55.37,2.03)
TX1: length 45.4
  Top Layer w0.254: v1(29.59,5.46) 29.59,8.64 28.28,9.95 U21.8 ; CO1.3 55.25,15 v1(55.25,11.56)
  Inner2 w0.254: v1(29.59,5.46) 29.59,4.32 31.52,2.39 54.08,2.39 55.25,3.56 v1(55.25,11.56)
TX2: length 54.4
  Top Layer w0.254: v1(55.37,20.57) 55.37,23.72 CO2.3 ; U21.7 27.47,10.54 28.45,10.54 30.23,8.76 v1(30.23,6.22)
  Inner2 w0.254: v1(30.23,6.22) 30.23,4.19 31.67,2.74 53.93,2.74 54.87,3.68 54.87,10.28 54.48,10.67 54.48,12.32 55.37,13.21 v1(55.37,20.57)
TX3: length 40
  Top Layer w0.254: CO3.3 55.75,32.4 v1(55.75,28.58) ; v1(30.1,10.41) 29.27,11.25 27.41,11.25
  Inner1 w0.254: v1(55.75,28.58) 37.97,10.79 34.99,10.79 34.61,10.41 v1(30.1,10.41)
TX4: length 47.8
  Top Layer w0.254: CO4.3 55.75,40.47 v1(55.75,36.7) ; U21.5 v1(29.46,11.9)
  Inner1 w0.254: v1(55.75,36.7) 55.75,32.19 53.85,30.29 53.85,27.17 37.83,11.15 34.71,11.15 34.33,10.77 30.99,10.77 29.86,11.9 v1(29.46,11.9)
TX5: length 27.6
  Top Layer w0.254: U21.4 v1(30.23,12.55) ; CO5.3 45.59,4.45 v1(45.59,4.44)
  Inner1 w0.254: v1(45.59,4.44) 43.18,6.86 33.52,6.86 30.55,9.83 29.54,9.83 28.7,10.67 28.7,12.19 29.06,12.55 v1(30.23,12.55)
TX6: length 23.1
  Top Layer w0.254: v1(45.85,12.06) 45.84,12.07 45.84,15 ; U21.3 v1(29.46,13.2)
  Inner1 w0.254: v1(29.46,13.2) 32.9,13.2 33.91,12.19 38.04,12.19 v1(39.59,13.75)
  Bottom Layer w0.254: v1(45.85,12.06) 44.17,13.75 v1(39.59,13.75)
TX7: length 23.3
  Top Layer w0.254: U21.2 v1(30.23,13.85) ; v1(45.34,21.97) 45.33,21.98 45.33,23.68
  Inner1 w0.254: v1(30.23,13.85) 34.1,13.85 40.96,20.7 44.58,20.7 45.34,21.46 v1(45.34,21.97)
TX8: length 27.1
  Top Layer w0.254: v1(34.7,13.62) 34.48,13.85 U21.23 ; v1(45.97,28.96) 45.57,29.36 CO8.3
  Inner1 w0.254: v1(45.97,28.96) 45.97,21.59 39.18,14.79 35.87,14.79 v1(34.7,13.62)
TX9: length 36.4
  Top Layer w0.254: U21.22 34.17,13.2 v1(34.54,12.83) ; CO9.3 45.97,40.4 v1(45.97,37.21)
  Inner1 w0.254: v1(45.97,37.21) 46.56,36.63 46.56,21.67 37.71,12.83 v1(34.54,12.83)
TX_SIG: length 27.5
  Top Layer w0.254: v1(26.16,15.24) 26.67,15.24 U21.1 27.4,14.49 R16.1 ; v1(12.95,24.77) 12.06,24.77 11.31,25.52 ESP.11
  Inner2 w0.254: v1(26.16,15.24) 26.16,18.92 24.13,20.95 16.76,20.95 v1(12.95,24.77)
USB_D_MINUS: length 53.2
  Top Layer w0.254: U19.2 10.92,40.26 v1(9.53,40.26) 9.45,40.34 USB-C.B7 6.68,40.34 6.48,40.13 6.48,39.5 6.64,39.34 USB-C.A7 ; v1(17.4,18.92) 17.65,19.18 ESP.23 ; USB.3 6.23,5.34 v1(6.98,6.1)
  Inner1 w0.254: v1(6.98,6.1) 6.98,8.51 v1(17.4,18.92)
  Inner2 w0.254: v1(17.4,18.92) 9.85,26.47 9.85,38.47 9.53,38.8 v1(9.53,40.26)
USB_D_PLUS: length 52.1
  Top Layer w0.254: v1(7.87,8) 7.37,8 5.96,6.59 USB.2 ; v1(10.29,38.86) 9.53,38.86 8.55,39.84 USB-C.A6 ; v1(10.29,38.86) 11.07,38.86 U18.2 ; v1(10.29,38.86) 10.26,38.84 USB-C.B6 ; ESP.24 18.5,19.22 v1(18.8,18.92)
  Inner1 w0.254: v1(7.87,8) 7.87,8.89 17.27,18.29 18.16,18.29 v1(18.8,18.92)
  Inner2 w0.254: v1(18.8,18.92) 17.78,19.94 16.89,19.94 10.29,26.54 v1(10.29,38.86)
$3N1694: length 4
  Top Layer w0.254: 7.87,40.78 9.03,40.78 10.55,42.29 R6.2
$3N1724: length 3.9
  Top Layer w0.254: USB-C.B5 9.15,37.84 10.01,36.98 R7.2
$6N462: length 3
  Top Layer w0.254: U15.C2 10.13,65.06 9.53,65.65 R4.1
$6N468: length 2.2
  Top Layer w0.254: R5.2 11.38,65.83 11.41,65.81

## Copper pours and planes (outline as drawn; the poured copper is in the pictures)
GND on Top Layer: 0,45 61.84,45 61.84,0 0,0
GND on Top Layer: 0,79.38 20.96,79.38 20.96,47.09 0,47.09
GND on Bottom Layer: 0,45 61.84,45 61.84,0 0,0
GND on Bottom Layer: 0,79.38 20.96,79.38 20.96,47.09 0,47.09
GND on Inner1: 0,79.38 20.96,79.38 20.96,47.09 0,47.09
GND on Inner1: 0,45 61.84,45 61.84,0 0,0
GND on Inner2: 0,79.38 20.96,79.38 20.96,47.09 0,47.09
GND on Inner2: 0,45 61.84,45 61.84,0 0,0
